# EAGLE design ESP32 TFT Touch with Camera(3.2'' ili9341) v1.1 (EAGLE 6.1)
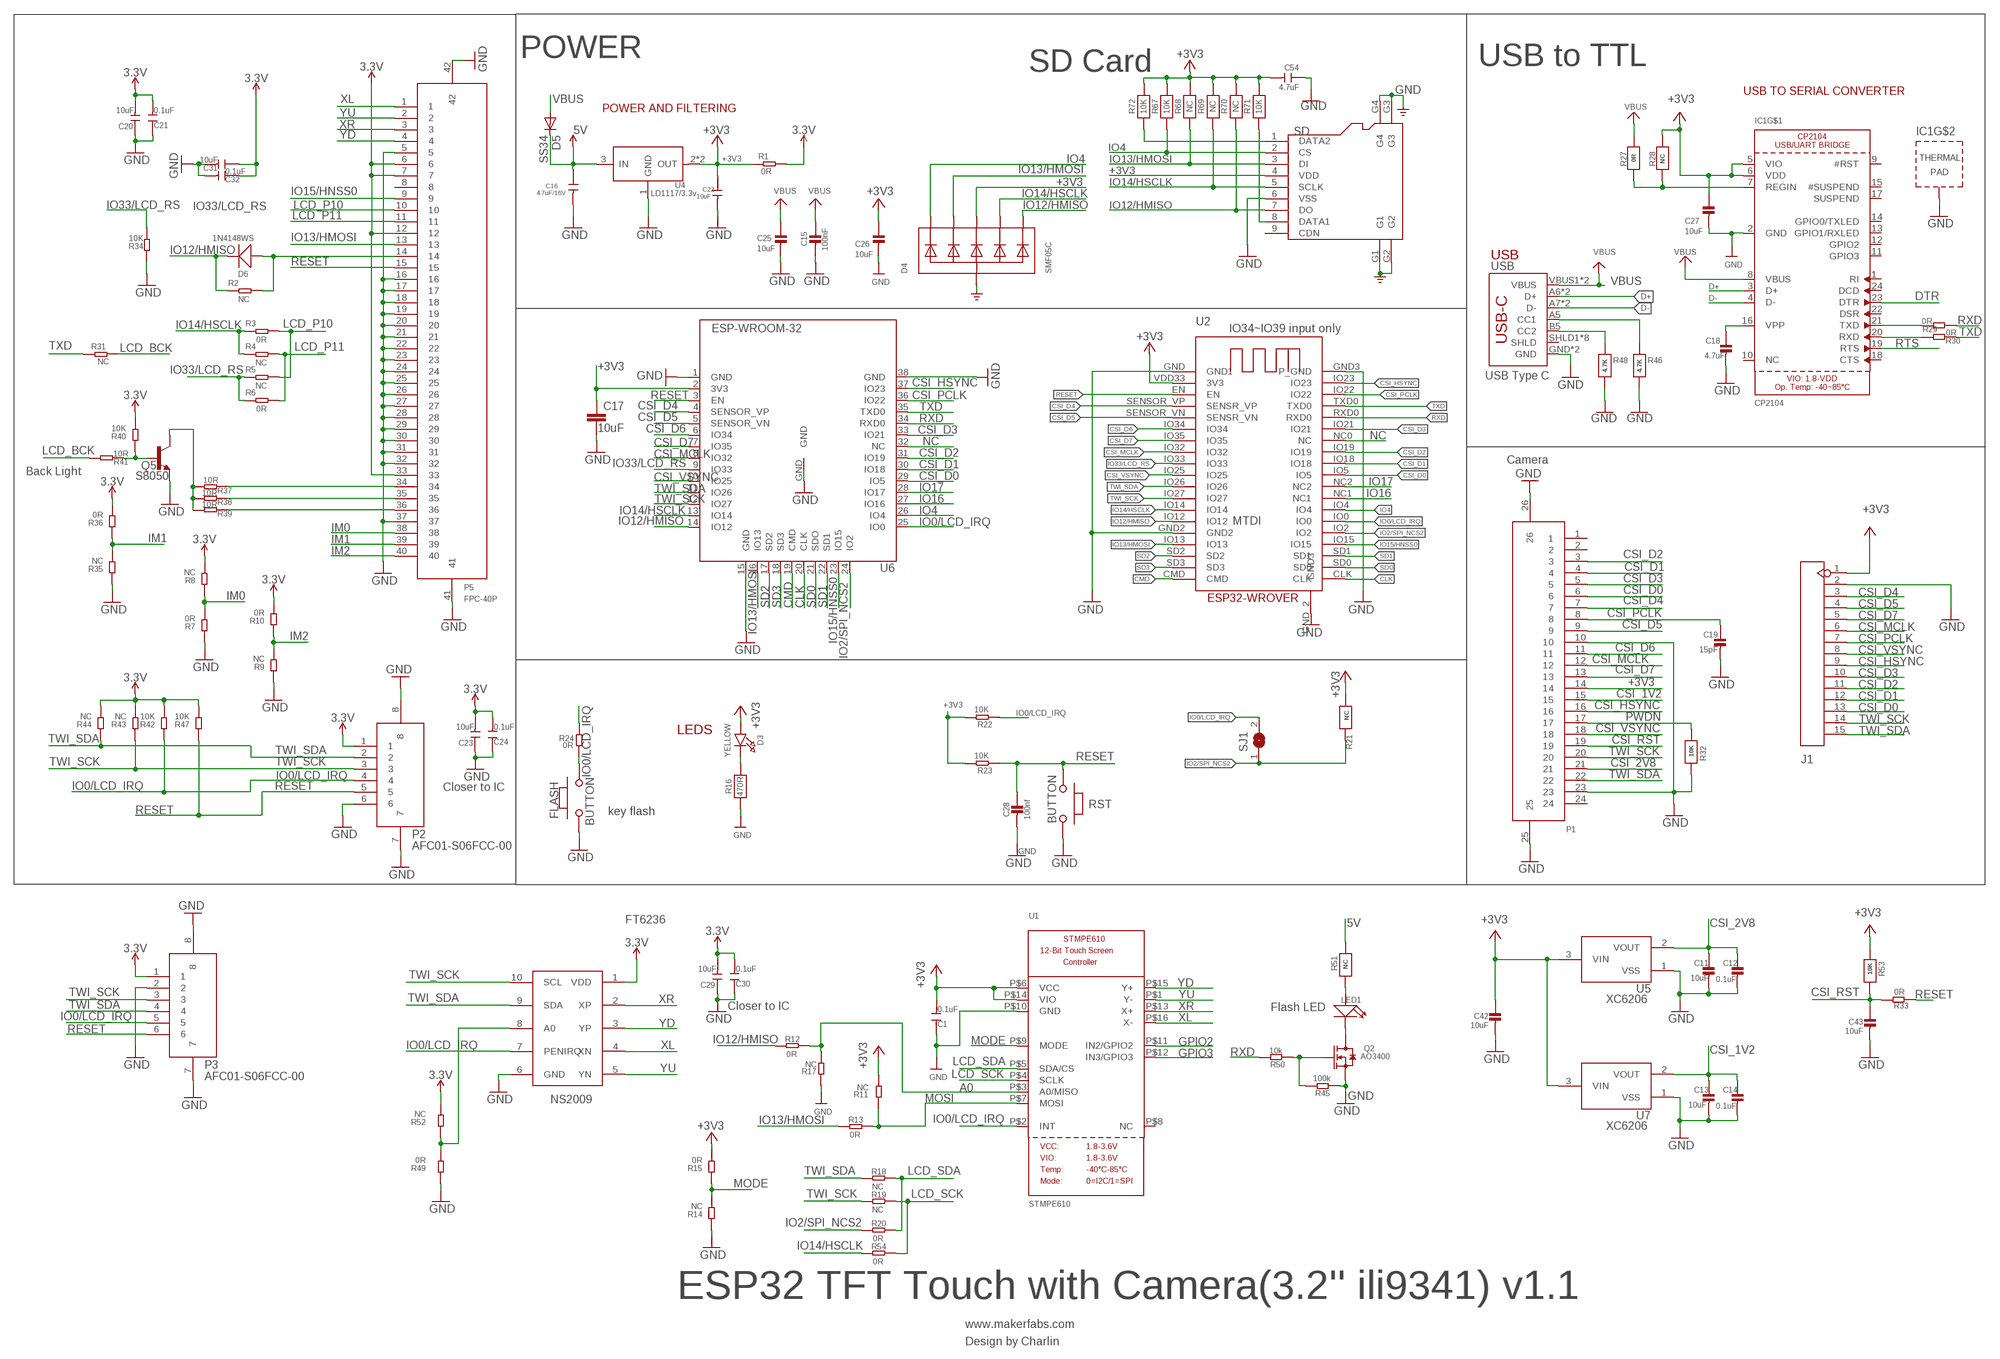
[diagram p0: schematic, sheet 1, part 1 of 2]
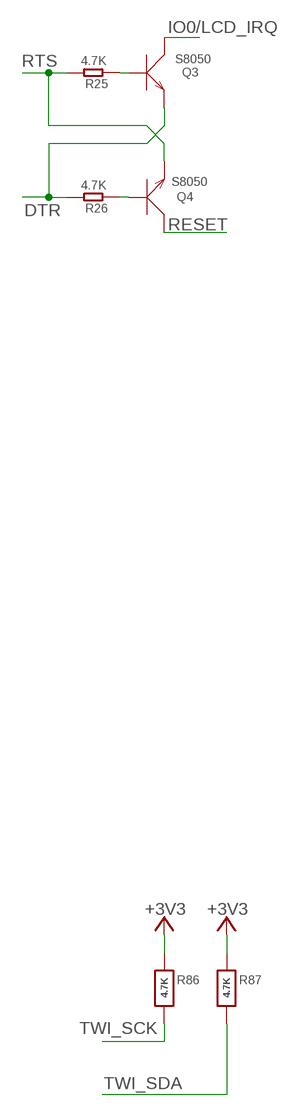
[diagram p1: schematic, sheet 1, part 2 of 2]

## Parts
C1  0.1uF  DISCRETE_C-0603  [DISCRETE_C0603]
C11  10uF  CAP_CERAMIC0603_NO  [0603-NO]
C12  0.1uF  CAP_CERAMIC0603_NO  [0603-NO]
C13  10uF  CAP_CERAMIC0603_NO  [0603-NO]
C14  0.1uF  CAP_CERAMIC0603_NO  [0603-NO]
C15  100nF  CAP_CERAMIC0603_NO  [0603-NO]
C16  4.7uF/16V  C-0603  [0603]
C17  10uF  C-EUC0603  [C0603]
C18  4.7uF  CAP_CERAMIC0603_NO  [0603-NO]
C19  15pF  CAP_CERAMIC0603_NO  [0603-NO]
C20  10uF  DISCRETE_C-0603  [DISCRETE_C0603]
C21  0.1uF  DISCRETE_C-0603  [DISCRETE_C0603]
C22  10uF  C-0603  [0603]
C23  10uF  DISCRETE_C-0603  [DISCRETE_C0603]
C24  0.1uF  DISCRETE_C-0603  [DISCRETE_C0603]
C25  10uF  CAP_CERAMIC0603_NO  [0603-NO]
C26  10uF  CAP_CERAMIC0603_NO  [0603-NO]
C27  10uF  CAP_CERAMIC0603_NO  [0603-NO]
C28  100nf  CAP_CERAMIC0603_NO  [0603-NO]
C29  10uF  DISCRETE_C-0603  [DISCRETE_C0603]
C30  0.1uF  DISCRETE_C-0603  [DISCRETE_C0603]
C31  10uF  DISCRETE_C-0603  [DISCRETE_C0603]
C32  0.1uF  DISCRETE_C-0603  [DISCRETE_C0603]
C42  10uF  CAP_CERAMIC0603_NO  [0603-NO]
C43  10uF  CAP_CERAMIC0603_NO  [0603-NO]
C54  4.7uF  DISCRETE_C-0603  [DISCRETE_C0603]
D3  YELLOW  LED0805_NOOUTLINE  [CHIPLED_0805_NOOUTLINE]
D4  SMF05C  TVSARRAY_5LANE  [SOT363]
D5  SS34  DIODE-DO-214AC  [DO-214AC]
D6  1N4148WS  D'0805'  [SOD323]
FLASH  BUTTON  PB157  [157SW]
IC1  CP2104  [QFN24_4MM_SMSC]
J1  HEADER-1X15P  [SMD15-2.54P8.5H]
LED1  DISCRETE_LED3528  [DISCRETE_LED-3528]
P1  FPC-24P  [SMD26-50P-1760L450W]
P2  AFC01-S06FCC-00  [SMD8-50P-740L535W]
P3  AFC01-S06FCC-00  [SMD8-50P-740L535W]
P5  FPC-40P  [SMD42-50P-2560L490W]
Q2  AO3400  MOSFET-N'SOT23'  [SOT23@1]
Q3  S8050  TRANSISTOR-NPN-SOT23  [SOT23]
Q4  S8050  TRANSISTOR-NPN-SOT23  [SOT23]
Q5  S8050  SPARKFUN_TRANSISTOR_NPNSOT23  [SPARKFUN_SOT23]
R1  0R  R-0603  [R0603]
R2  NC  R-0603  [R0603]
R3  0R  R-0603  [R0603]
R4  NC  R-0603  [R0603]
R5  NC  R-0603  [R0603]
R6  0R  R-0603  [R0603]
R7  0R  DISCRETE_R-0603  [DISCRETE_R0603]
R8  NC  DISCRETE_R-0603  [DISCRETE_R0603]
R9  NC  DISCRETE_R-0603  [DISCRETE_R0603]
R10  0R  DISCRETE_R-0603  [DISCRETE_R0603]
R11  NC  DISCRETE_R-0603  [DISCRETE_R0603]
R12  0R  R-0603  [R0603]
R13  0R  R-0603  [R0603]
R14  NC  DISCRETE_R-0603  [DISCRETE_R0603]
R15  0R  DISCRETE_R-0603  [DISCRETE_R0603]
R16  470R  RESISTOR_0603_NOOUT  [0603-NO]
R17  NC  DISCRETE_R-0603  [DISCRETE_R0603]
R18  NC  R-0603  [R0603]
R19  NC  R-0603  [R0603]
R20  0R  R-0603  [R0603]
R21  NC  RESISTOR_0603_NOOUT  [0603-NO]
R22  10K  R-0603  [R0603]
R23  10K  R-0603  [R0603]
R24  0R  R-0603  [R0603]
R25  4.7K  R-0603  [R0603]
R26  4.7K  R-0603  [R0603]
R27  0R  RESISTOR_0603_NOOUT  [0603-NO]
R28  NC  RESISTOR_0603_NOOUT  [0603-NO]
R29  0R  R-0603  [R0603]
R30  0R  R-0603  [R0603]
R31  NC  R-0603  [R0603]
R32  10K  RESISTOR_0603_NOOUT  [0603-NO]
R33  0R  R-0603  [R0603]
R34  10K  DISCRETE_R-0603  [DISCRETE_R0603]
R35  NC  DISCRETE_R-0603  [DISCRETE_R0603]
R36  0R  DISCRETE_R-0603  [DISCRETE_R0603]
R37  10R  DISCRETE_R-0603  [DISCRETE_R0603]
R38  10R  DISCRETE_R-0603  [DISCRETE_R0603]
R39  10R  DISCRETE_R-0603  [DISCRETE_R0603]
R40  10K  DISCRETE_R-0603  [DISCRETE_R0603]
R41  10R  DISCRETE_R-0603  [DISCRETE_R0603]
R42  10K  DISCRETE_R-0603  [DISCRETE_R0603]
R43  NC  DISCRETE_R-0603  [DISCRETE_R0603]
R44  NC  DISCRETE_R-0603  [DISCRETE_R0603]
R45  100k  R-0603  [R0603]
R46  4.7K  RESISTOR_0603_NOOUT  [0603-NO]
R47  10K  DISCRETE_R-0603  [DISCRETE_R0603]
R48  4.7K  RESISTOR_0603_NOOUT  [0603-NO]
R49  0R  DISCRETE_R-0603  [DISCRETE_R0603]
R50  10k  R-0603  [R0603]
R51  NC  RESISTOR_0603_NOOUT  [0603-NO]
R52  NC  DISCRETE_R-0603  [DISCRETE_R0603]
R53  10K  RESISTOR_0603_NOOUT  [0603-NO]
R54  0R  R-0603  [R0603]
R67  10K  RESISTOR_0603_NOOUT  [0603-NO]
R68  NC  RESISTOR_0603_NOOUT  [0603-NO]
R69  NC  RESISTOR_0603_NOOUT  [0603-NO]
R70  NC  RESISTOR_0603_NOOUT  [0603-NO]
R71  10K  RESISTOR_0603_NOOUT  [0603-NO]
R72  10K  RESISTOR_0603_NOOUT  [0603-NO]
R86  4.7K  RESISTOR_0603_NOOUT  [0603-NO]
R87  4.7K  RESISTOR_0603_NOOUT  [0603-NO]
RST  BUTTON  PB157  [157SW]
SD  HOLDER-MICROSD-9P  [9P-SMD-W/-RING]
SJ1  SJ  [SJ]
U1  STMPE610  [QFN16_3MM]
U2  ESP32-WROVER  [ESP32-WROVER]
U4  LD1117/3.3v  LD1117'SOT89'  [SOT89]
U5  XC6206  [SOT-23]
U6  ESP-WROOM-32  [ESP-WROOM-32]
U7  XC6206  [SOT-23]
U8  NS2009  [MSOP10]
USB  USB_C5  [USB-C-16P-5]

## Nets
3.3V: C20.2 C21.2 C23.2 C24.2 C29.2 C30.2 C31.1 C32.1 P2.1 P3.1 P5.6 P5.7 P5.12 P5.33 R1.2 R8.2 R10.2 R36.2 R40.2 R42.2 R43.2 R44.2 R47.2 R52.2 U8.1(VDD)
5V: C16.1 D5.C R51.1 U4.3(IN)
+3V3: C1.2 C17.1 C22.1 C26.1 C27.1 C42.1 C54.2 D3.A D4.4(C3) IC1.5(VIO) IC1.6(VDD) J1.1 P1.14 R1.1 R11.2 R15.2 R21.1 R22.2 R23.2 R28.1 R53.1 R67.2 R68.2 R69.2 R70.2 R71.2 R72.2 R86.1 R87.1 SD.4(VDD) U1.P$6(VCC) U1.P$14(VIO) U2.VDD33(3V3) U4.2(OUT) U4.4(OUT) U5.3(VIN) U6.2(3V3) U7.3(VIN)
A0: R12.2 R17.2 U1.P$3(A0/MISO)
CLK: U2.CLK U6.20(CLK)
CMD: U2.CMD U6.19(CMD)
CSI_1V2: C13.1 C14.1 P1.15 U7.2(VOUT)
CSI_2V8: C11.1 C12.1 P1.21 U5.2(VOUT)
CSI_D0: J1.13 P1.6 U2.IO5 U6.29(IO5)
CSI_D1: J1.12 P1.4 U2.IO18 U6.30(IO18)
CSI_D2: J1.11 P1.3 U2.IO19 U6.31(IO19)
CSI_D3: J1.10 P1.5 U2.IO21 U6.33(IO21)
CSI_D4: J1.3 P1.7 U2.SENSOR_VP(SENSR_VP) U6.4(SENSOR_VP)
CSI_D5: J1.4 P1.9 U2.SENSOR_VN(SENSR_VN) U6.5(SENSOR_VN)
CSI_D6: P1.11 U2.IO34 U6.6(IO34)
CSI_D7: J1.5 P1.13 U2.IO35 U6.7(IO35)
CSI_HSYNC: J1.9 P1.16 U2.IO23 U6.37(IO23)
CSI_MCLK: J1.6 P1.12 U2.IO32 U6.8(IO32)
CSI_PCLK: C19.1 J1.7 P1.8 U2.IO22 U6.36(IO22)
CSI_RST: C43.1 P1.19 R33.2 R53.2
CSI_VSYNC: J1.8 P1.18 U2.IO25 U6.10(IO25)
D+: IC1.3(D+) USB.A6(D+) USB.B6(D+)
D-: IC1.4(D-) USB.A7(D-) USB.B7(D-)
DTR: IC1.23(DTR) Q3.2(E) R26.2
GND: C1.1 C11.2 C12.2 C13.2 C14.2 C15.2 C16.2 C17.2 C18.2 C19.2 C20.1 C21.1 C22.2 C23.1 C24.1 C25.2 C26.2 C27.2 C28.2 C29.1 C30.1 C31.2 C32.2 C42.2 C43.2 C54.1 D4.2(A) FLASH.1 IC1.2(GND) IC1.THERM(TP) J1.2 P1.10 P1.23 P1.25 P1.26 P2.6 P2.7 P2.8 P3.2 P3.7 P3.8 P5.5 P5.16 P5.17 P5.18 P5.19 P5.20 P5.21 P5.22 P5.23 P5.24 P5.25 P5.26 P5.27 P5.28 P5.29 P5.30 P5.31 P5.32 P5.37 P5.41 P5.42 Q2.2(S) Q5.2(E) R7.1 R9.1 R14.1 R16.1 R17.1 R32.2 R34.1 R35.1 R45.1 R46.2 R48.2 R49.1 RST.1 SD.6(VSS) SD.G1 SD.G2 SD.G3 SD.G4 U1.P$10(GND) U2.GND2 U2.GND3(P_GND) U2.GND(GND1) U2.GND_2(GND3) U4.1(GND) U5.1(VSS) U6.1(GND) U6.15(GND) U6.38(GND) U6.GND U7.1(VSS) U8.6(GND) USB.GND USB.GND2(GND)
GPIO2: U1.P$11(IN2/GPIO2)
GPIO3: U1.P$12(IN3/GPIO3)
IM0: P5.38 R7.2 R8.1
IM1: P5.39 R35.2 R36.1
IM2: P5.40 R9.2 R10.1
IO0/LCD_IRQ: P2.4 P3.5 Q3.3(C) R22.1 R24.2 R42.1 SJ1.2 U1.P$2(INT) U2.IO0 U6.25(IO0) U8.7(PENIRQ)
IO2/SPI_NCS2: R20.1 R21.2 SJ1.1 U2.IO2 U6.24(IO2)
IO4: D4.1(C1) R67.1 SD.2(CS) U2.IO4 U6.26(IO4)
IO12/HMISO: D4.6(C5) D6.- R2.1 R12.1 R70.1 SD.7(DO) U2.IO12 U6.14(IO12)
IO13/HMOSI: D4.3(C2) P5.13 R13.1 R68.1 SD.3(DI) U2.IO13 U6.16(IO13)
IO14/HSCLK: D4.5(C4) R3.1 R4.1 R54.1 R69.1 SD.5(SCLK) U2.IO14 U6.13(IO14)
IO15/HNSS0: P5.9 U2.IO15 U6.23(IO15)
IO16: U2.NC1 U6.27(IO16)
IO17: U2.NC2 U6.28(IO17)
IO33/LCD_RS: R5.1 R6.1 R34.2 U2.IO33 U6.9(IO33)
LCD_BCK: R31.2 R41.2
LCD_P10: P5.10 R3.2 R5.2
LCD_P11: P5.11 R4.2 R6.2
LCD_SCK: R19.2 R54.2 U1.P$4(SCLK)
LCD_SDA: R18.2 R20.2 U1.P$5(SDA/CS)
MODE: R14.2 R15.1 U1.P$9(MODE)
MOSI: R11.1 R13.2 U1.P$7(MOSI)
N$1: C18.1 IC1.16(VPP)
N$2: Q4.1(B) R26.1
N$3: Q3.1(B) R25.1
N$4: D6.+ P5.14 R2.2
N$5: Q2.1(G) R45.2 R50.1
N$6: FLASH.2 R24.1
N$7: D3.C R16.2
N$8: LED1.1(+) R51.2
N$9: LED1.2(-) Q2.3(D)
N$10: R46.1 USB.A5(CC1)
N$11: R48.1 USB.B5(CC2)
N$12: IC1.7(REGIN) R27.2 R28.2
N$18: IC1.21(TXD) R29.2
N$19: IC1.20(RXD) R30.2
N$20: P5.34 R37.1
N$21: P5.35 R38.1
N$22: P5.36 R39.1
N$23: Q5.1(B) R40.1 R41.1
N$24: Q5.3(C) R37.2 R38.2 R39.2
N$25: R49.2 R52.1 U8.8(A0)
N$47: R72.1 SD.1(DATA2)
N$48: R71.1 SD.8(DATA1)
NC: U2.NC0(NC) U6.32(NC)
PWDN: P1.17 R32.1
RESET: C28.1 P2.5 P3.6 P5.15 Q4.3(C) R23.1 R33.1 R47.1 RST.2 U2.EN U6.3(EN)
RTS: IC1.19(RTS) Q4.2(E) R25.2
RXD: R29.1 R50.2 U2.RXD0 U6.34(RXD0)
SD0: U2.SD0 U6.21(SDO)
SD1: U2.SD1 U6.22(SD1)
SD2: U2.SD2 U6.17(SD2)
SD3: U2.SD3 U6.18(SD3)
TWI_SCK: J1.14 P1.20 P2.3 P3.3 R19.1 R43.1 R86.2 U2.IO27 U6.12(IO27) U8.10(SCL)
TWI_SDA: J1.15 P1.22 P2.2 P3.4 R18.1 R44.1 R87.2 U2.IO26 U6.11(IO26) U8.9(SDA)
TXD: R30.1 R31.1 U2.TXD0 U6.35(TXD0)
VBUS: C15.1 C25.1 D5.A IC1.8(VBUS) R27.1 USB.VBUS1(VBUS) USB.VBUS2(VBUS)
XL: P5.1 U1.P$16(X-) U8.4(XN)
XR: P5.3 U1.P$13(X+) U8.2(XP)
YD: P5.4 U1.P$15(Y+) U8.3(YP)
YU: P5.2 U1.P$1(Y-) U8.5(YN)
Unconnected: IC1.1(RI) IC1.9(#RST) IC1.10(NC) IC1.11(GPIO3) IC1.12(GPIO2) IC1.13(GPIO1/RXLED) IC1.14(GPIO0/TXLED) IC1.15(#SUSPEND) IC1.17(SUSPEND) IC1.18(CTS) IC1.22(DSR) IC1.24(DCD) P1.1 P1.2 P1.24 P5.8 SD.9(CDN) U1.P$8(NC) USB.SHLD1(SHLD) USB.SHLD2(SHLD) USB.SHLD3(SHLD) USB.SHLD4(SHLD) USB.SHLD5(SHLD) USB.SHLD6(SHLD) USB.SHLD7(SHLD) USB.SHLD8(SHLD)

## Notes on the sheet
- POWER | USB to TTL
- SD Card
- USB TO SERIAL CONVERTER
- POWER AND FILTERING
- IO33/LCD_RS
- USB
- IO34~IO39 input only
- USB Type C
- Camera
- Back Light
- MTDI
- LEDS
- Closer to IC
- key flash
- FT6236
- Closer to IC | Flash LED
- NS2009
- ESP32 TFT Touch with Camera(3.2'' ili9341) v1.1
- www.makerfabs.com
- Design by Charlin

## Library data of the parts
C1 C20 C21 C23 C24 C29-C32 C54 = A9G:DISCRETE_C*: Ceramic Capacitors
C11-C15 C18 C19 C25-C28 C42 C43 = microbuilder:CAP_CERAMIC: Ceramic Capacitors For new designs, use the packages preceded by an '_' character since they are more reliable: The following footprints should be used on most boards: _0402 - Standard footprint for regular board layouts _0603 - Standard footprint for regular board layouts _0805 - Standard footprint for regular board layouts _1206 - Standard footprint for regular board layouts For extremely tight-pitch boards where space is at a premium, the following 'micro-pitch' footprints can be used (smaller pads, no silkscreen outline, etc.): _0402MP - Micro-pitch footprint for very dense/compact boards _0603MP - Micro-pitch footprint for very dense/compact boards _0805MP - Micro-pitch footprint for very dense/compact boards _1206MP - Micro-pitch footprint for very dense/compact boards
C16 C22 = Discrete:C*: Ceramic Capacitors
C17 = rcl:C-EU: CAPACITOR, European symbol
D3 = microbuilder:LED: LED 0603 - 0603 Surface Mount Package 2mA: Green LED - Low Power (3.9mcd, 2ma, 1.7Vf) - Digikey: 475-2709-2-ND Orange LED - Low Power (9.8mcd, 2ma, 1.8Vf) - Digikey: 475-1194-2-ND Red LED - Low Power (5mcd, 2ma, 1.8Vf) - Digikey: 475-1195-2-ND Yellow LED - Low Power (7mcd, 2ma, 1.8Vf) - Digikey: 475-1196-2-ND 5mA: Blue LED - Low Power (17mcd, 5ma, 2.9Vf) - Digikey: LNJ937W8CRACT-ND 0805 - 0805 Surface Mount Package 2mA: Red LED (8.8mcd, 2mA, 1.8Vf, Clear) - Low Power [Digikey: 475-2510-1-ND] Green LED (5mcd, 2mA, 1.8Vf, Clear) - Low Power [Digikey: 475-2730-1-ND] Yellow LED (11.3mcd, 2mA, 1.8Vf, Clear) - Low Power [Digikey: 475-2555-1-ND] 20mA: Red LED (104mcd, 20mA, Diffused) - LS R976 [Digikey: 475-1278-6-ND] Red LED (12mcd, 20mA, 2.0Vf, Clear) - APT2012EC [Digikey: 754-1128-1-ND] Green LED (15mcd, 20mA, 2.2Vf, Clear) - APT2012GC [Digikey: 754-1131-1-ND] Orange LED (160mcd, 20mA, 2.1Vf, Clear) - APT2012SECK [Digikey: 754-1130-1-ND] 1206 - 1206 Surface Mount Package Green LED (26mcd, 20mA, Diffused) - LG N971 [Digikey: 475-1407-6-ND] Red LED (15mcd, 20mA, Diffused) - LH N974 [Digikey: 475-1416-6-ND] Cree - Cree High-Power Surface Mount LEDs XPEBWT-L1-0000-00D50 - White 111lm 350mA 2.9Vf 6200K 110° XTEAWT-00-0000-00000LEE3 - White 114lm 350mA 2.85Vf 5000K 115° Everlight - Everlight 45-21 Series Surface Mount LEDs 45-21/QK2C-B2832AC2CB2/2T - Warm White 2000mcd 20mA 3.25Vf 3050K 120° 45-21/LK2C-B38452C4CB2/2T - Nuetral White 2000mcd 20mA 3.25Vf 4150K 120° 45-21/LK2C-B50634C6CB2/2T - Cold White 2200mcd 20mA 3.25Vf 5650K 120° PLCC2 Reverse Mount LS T77K-J1L2-1-0-2-R18-Z - Red 11.25mcd 2mA 1.8Vf 630nm 120° LO T77K-L1M2-24-Z - Orange 19.6mcd 2mA 1.8Vf 606nm 120° LY T77K-K2M1-26-Z - Yellow 15.7mcd 2mA 1.8Vf 587nm 120°
D4 = microbuilder:TVSARRAY_5LANE: Voltage Transient Suppressor Array SOT363 SMF05C - 100W 5V: Digikey - SMF05CT1GOSCT-ND
D5 = diode:DIODE-: DIODE
D6 = Discrete:D*
FLASH RST = MySMD:PB157
IC1 = microbuilder:CP2104: CP2104 - USB to UART Bridge VDD Output: 3.45V
J1 = self:HEADER-1X15P
LED1 = Relay:DISCRETE_LED*
P1 = self:FPC-24P
P2 P3 = self:AFC01-S06FCC-00
P5 = self:FPC-40P
Q2 = Discrete:MOSFET-N: IRLL014: http://www.vishay.com/docs/91319/sihll014.pdf
Q3 Q4 = Discrete:TRANSISTOR-NPN*: NPN audion
Q5 = Adafruit_HUZZAH32_ESP32_Feather:SPARKFUN_TRANSISTOR_NPN: Transistor NPN BJT configuration in SOT23 package. MMBT2222 is the common NPN we use. Double check BCE configuration again layout.
R1-R6 R12 R13 R18-R20 R22-R26 R29-R31 R33 R45 R50 R54 = Discrete:R*
R7-R11 R14 R15 R17 R34-R44 R47 R49 R52 = A9G:DISCRETE_R*
R16 R21 R27 R28 R32 R46 R48 R51 R53 R67-R72 R86 R87 = microbuilder:RESISTOR: Resistors For new designs, use the packages preceded by an '_' character since they are more reliable: The following footprints should be used on most boards: _0402 - Standard footprint for regular board layouts _0603 - Standard footprint for regular board layouts _0805 - Standard footprint for regular board layouts _1206 - Standard footprint for regular board layouts For extremely tight-pitch boards where space is at a premium, the following 'micro-pitch' footprints can be used (smaller pads, no silkscreen outline, etc.): _0402MP - Micro-pitch footprint for very dense/compact boards _0603MP - Micro-pitch footprint for very dense/compact boards _0805MP - Micro-pitch footprint for very dense/compact boards _1206MP - Micro-pitch footprint for very dense/compact boards
SD = Connector:HOLDER-MICROSD-9P
SJ1 = jumper:SJ: SMD solder JUMPER
U1 = microbuilder:STMPE610: STMPE610 - 12-Bit Touch Screen Controller
U2 = ESP32-Wrover:ESP32-WROVER
U4 = IC:LD1117: Low Drop Fixed And Adjustable Positive Voltage Regulators http://www.datasheetcatalog.org/datasheet/SGSThomsonMicroelectronics/mXuqtqv.pdf
U5 U7 = self:XC6206
U6 = esp32:ESP-WROOM-32
U8 = NS2009:NS2009
USB = USBC:USB_C: USB Type C 16Pin Connector Super Speed pins not available on the 16-pin purely SMD connector so this part is best for USB 2.0 implementations. D1 and D2 are tied together enabling D+/- no matter which way the cable is plugged into the connector. The two channel configuration pins (CC1/2) are exposed. These are normally connected to ground via 5.1k resistors but can be reconfigured for high current/high power applications.

## Net classes
1 vbat: width 0.254 mm, drill 0.305 mm, clearance 0.152 mm

## Board
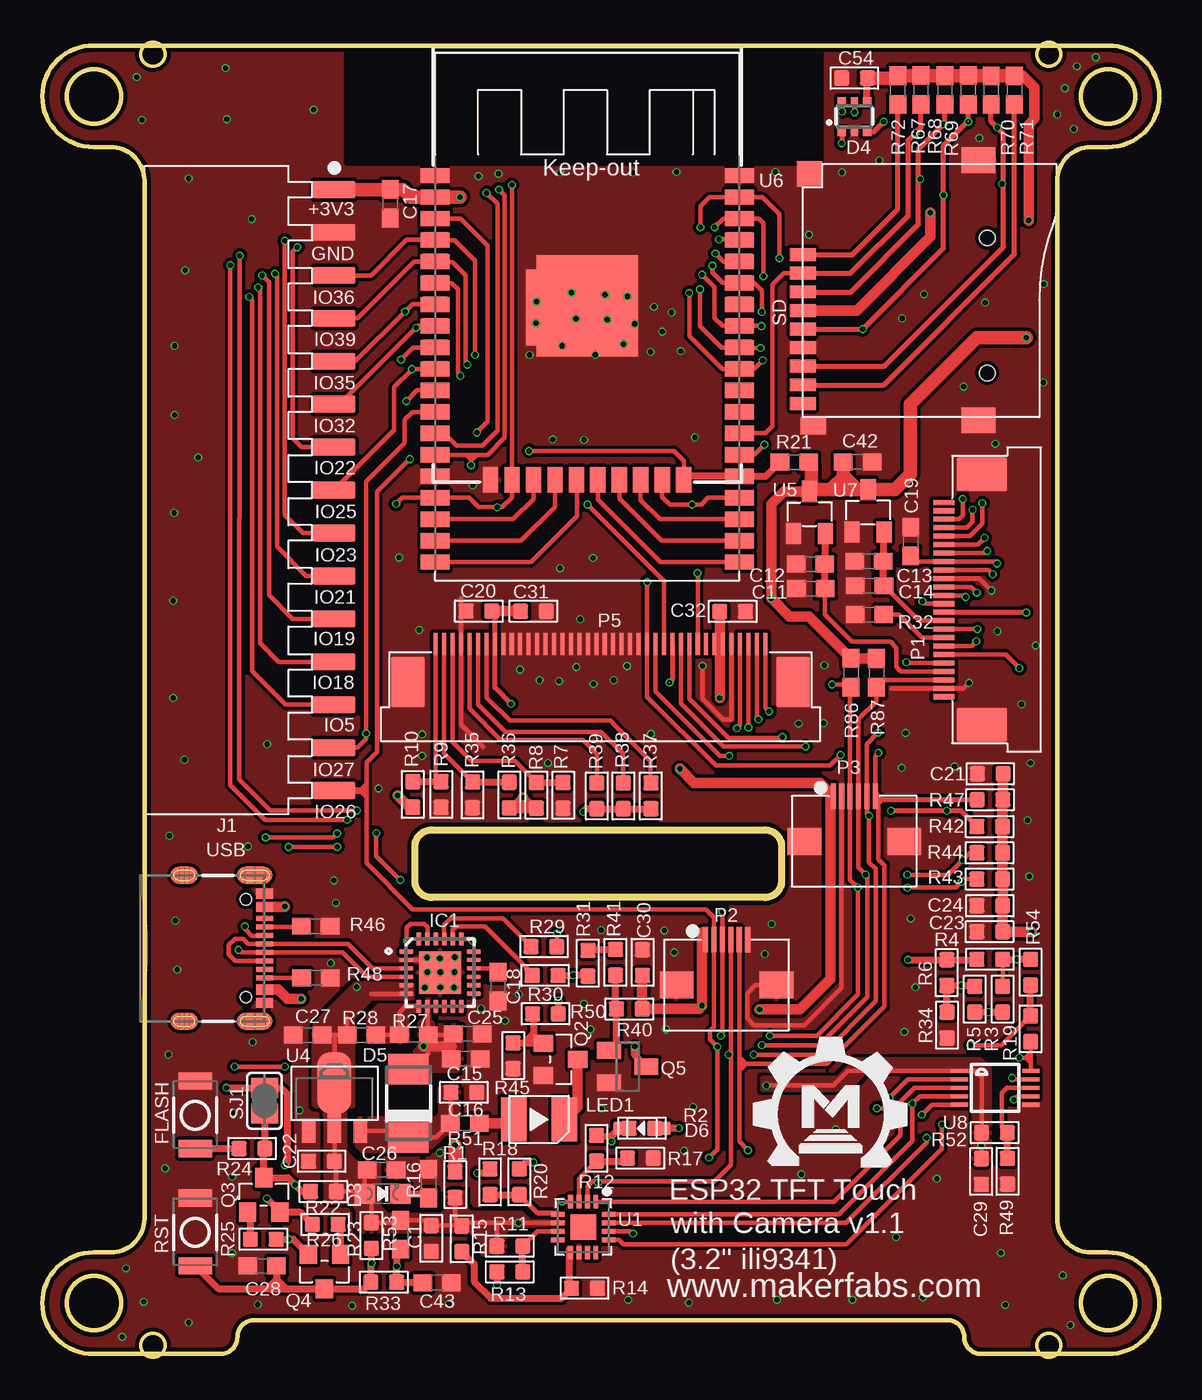
[diagram p2: board, top side]
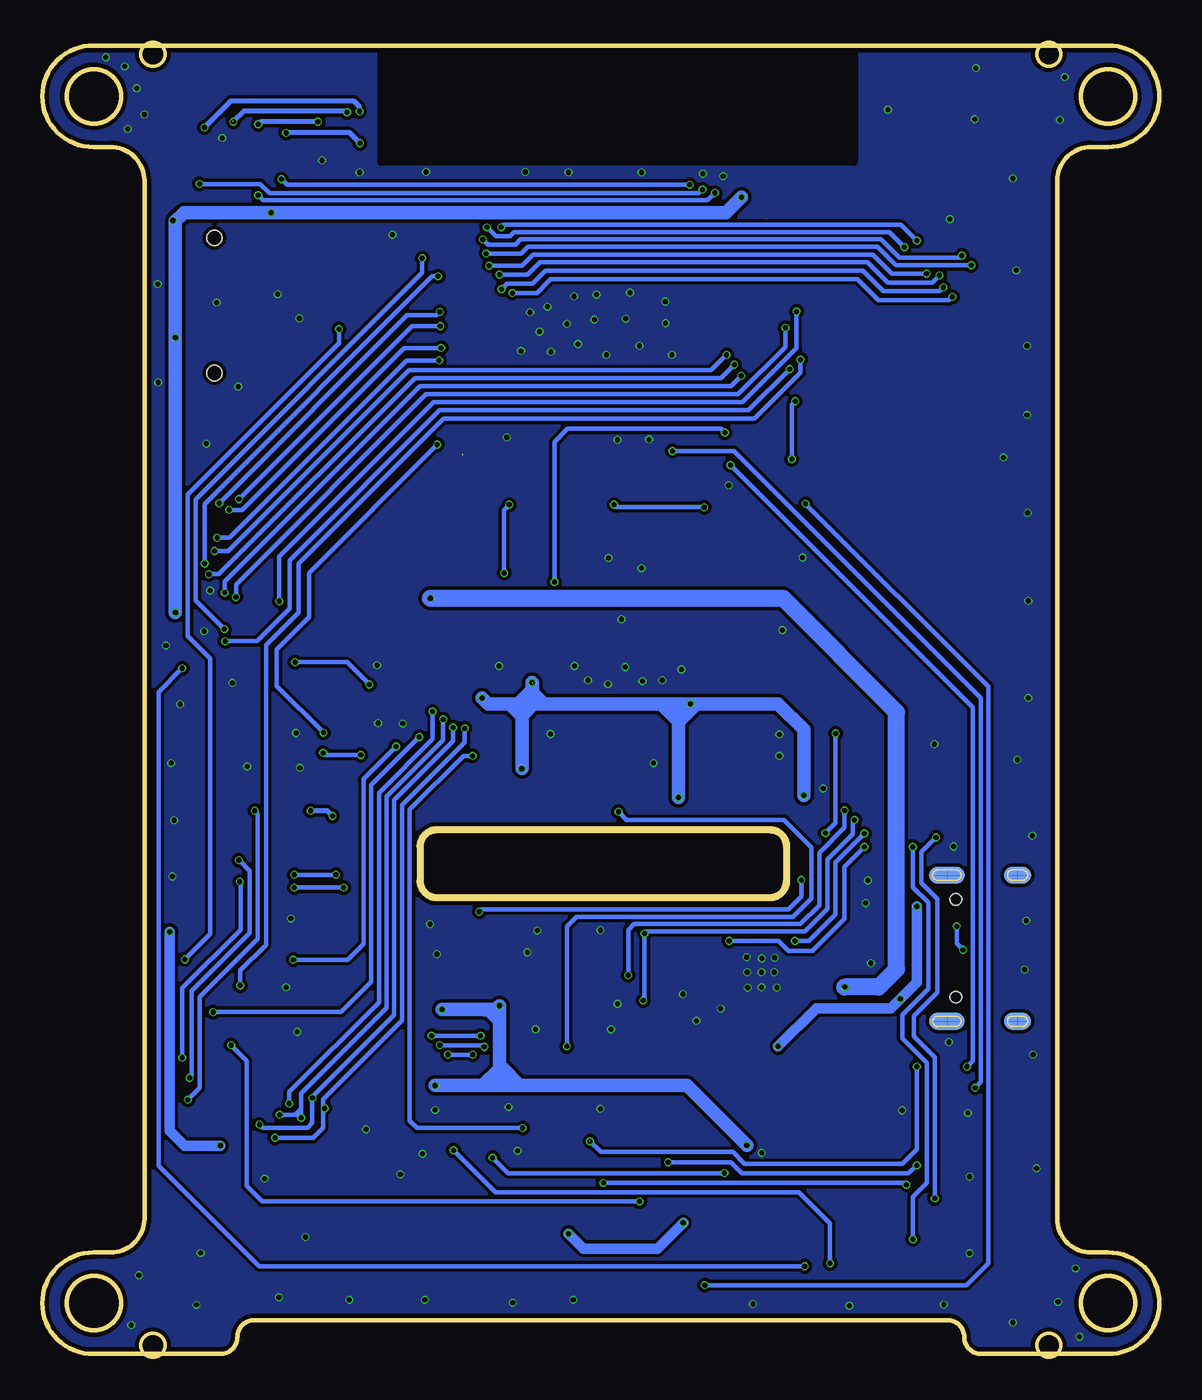
[diagram p3: board, bottom side, seen from below]

Size 66.1 x 77.8 mm. Coordinates in mm from the lower left corner, seen from the top.
Outline: 55.55,0.2 63.05,0.2 arc182 63.05,6.2 62.05,6.2 arc-90 60.05,8.2 60.05,69.6 arc-90 62.05,71.6 63.05,71.6 arc182 63.05,77.6 3.05,77.6 arc182 3.05,71.6 4.05,71.6 arc-90 6.05,69.6 6.05,8.2 arc-90 4.05,6.2 3.05,6.2 arc182 3.05,0.2 10.55,0.2 arc90 11.55,1.2 arc-90 12.55,2.2 53.55,2.2 arc-90 54.55,1.2 arc90 55.55,0.2
Outline: 23.05,31.2 42.75,31.2 arc-90 43.75,30.2 43.75,28.2 arc-90 42.75,27.2 23.05,27.2 arc-90 22.05,28.2 22.05,30.2 arc-90 23.05,31.2
Outline: circle at 3.05,74.6 radius 1.6
Outline: circle at 3.05,3.2 radius 1.6
Outline: circle at 63.05,3.2 radius 1.6
Outline: circle at 63.05,74.6 radius 1.6
Outline: circle at 6.55,0.7 radius 0.7
Outline: circle at 59.55,0.7 radius 0.7
Outline: circle at 59.55,77.1 radius 0.7
Outline: circle at 6.55,77.1 radius 0.7
Copper layers (1*16): Top 0.035mm / dielectric 1.5mm / Bottom 0.035mm
Design rules: minimum track width 6mil, minimum drill 10mil, track to track 6mil, track to pad 6mil, pad to pad 6mil, via to via 6mil, smd to smd 0mil, copper to edge 10mil, drill to drill 10mil, minimum pad ring 3mil, minimum via ring 3mil, stop-mask expansion 2mil, vias tented up to drill 100mil, thermal gap 0mil
tRestrict: area 18,70.7 to 46,77.7
bRestrict: area 18,70.7 to 46,77.7

### Footprints (pad centres in the part's own frame; a part is rotated, then mirrored left to right if it is on the bottom)
DISCRETE_C0603 = smd 0.889 x 0.889: 1 -0.762,0; 2 0.762,0
0603-NO = smd 1.1 x 1: 1 -0.85,0; 2 0.85,0
0603 = smd 0.889 x 0.889: 1 -0.762,0; 2 0.762,0
C0603 = smd 1.1 x 1: 1 -0.85,0; 2 0.85,0
CHIPLED_0805_NOOUTLINE = smd 1.2 x 1.2: A 0,-1.05; C 0,1.05
SOT363 = smd 0.5 x 0.5: 1 -0.75,-0.9; 3 0.75,-0.9; 4 0.75,0.9; 6 -0.75,0.9 | smd 0.4 x 0.5: 2 0,-0.9; 5 0,0.9
DO-214AC = smd 1.8 x 2.4: A 2.025,0; C -2.025,0
SOD323 = smd 1 x 0.8: + -1.2,0; - 1.2,0
157SW = smd 1.016 x 1.981: 1 0,0; 2 4,0
QFN24_4MM_SMSC = smd 0.8 x 0.28: 1 -2,1.25; 2 -2,0.75; 3 -2,0.25; 4 -2,-0.25; 5 -2,-0.75; 6 -2,-1.25; 13 2,-1.25; 14 2,-0.75; 15 2,-0.25; 16 2,0.25; 17 2,0.75; 18 2,1.25 | smd 0.28 x 0.8: 7 -1.25,-2; 8 -0.75,-2; 9 -0.25,-2; 10 0.25,-2; 11 0.75,-2; 12 1.25,-2; 19 1.25,2; 20 0.75,2; 21 0.25,2; 22 -0.25,2; 23 -0.75,2; 24 -1.25,2 | smd 2.5 x 2.5: THERM 0,0
SMD15-2.54P8.5H = smd 1.02 x 2.5: 1 -17.78,0; 2 -15.24,0; 3 -12.7,0; 4 -10.16,0; 5 -7.62,0; 6 -5.08,0; 7 -2.54,0; 8 0,0; 9 2.54,0; 10 5.08,0; 11 7.62,0; 12 10.16,0; 13 12.7,0; 14 15.24,0; 15 17.78,0
DISCRETE_LED-3528 = smd 1.5 x 2.6: 1 -1.5,0; 2 1.5,0
SMD26-50P-1760L450W = smd 0.3 x 1.3: 1 5.75,0; 2 5.25,0; 3 4.75,0; 4 4.25,0; 5 3.75,0; 6 3.25,0; 7 2.75,0; 8 2.25,0; 9 1.75,0; 10 1.25,0; 11 0.75,0; 12 0.25,0; 13 -0.25,0; 14 -0.75,0; 15 -1.25,0; 16 -1.75,0; 17 -2.25,0; 18 -2.75,0; 19 -3.25,0; 20 -3.75,0; 21 -4.25,0; 22 -4.75,0; 23 -5.25,0; 24 -5.75,0 | smd 2 x 3: 25 -7.4,-2.25; 26 7.4,-2.25
SMD8-50P-740L535W = smd 0.3 x 1.5: 1 -1.25,0; 2 -0.75,0; 3 -0.25,0; 4 0.25,0; 5 0.75,0; 6 1.25,0 | smd 2 x 1.6: 7 2.95,-2.68; 8 -2.95,-2.68
SMD42-50P-2560L490W = smd 0.3 x 1.3: 1 9.75,0; 2 9.25,0; 3 8.75,0; 4 8.25,0; 5 7.75,0; 6 7.25,0; 7 6.75,0; 8 6.25,0; 9 5.75,0; 10 5.25,0; 11 4.75,0; 12 4.25,0; 13 3.75,0; 14 3.25,0; 15 2.75,0; 16 2.25,0; 17 1.75,0; 18 1.25,0; 19 0.75,0; 20 0.25,0; 21 -0.25,0; 22 -0.75,0; 23 -1.25,0; 24 -1.75,0; 25 -2.25,0; 26 -2.75,0; 27 -3.25,0; 28 -3.75,0; 29 -4.25,0; 30 -4.75,0; 31 -5.25,0; 32 -5.75,0; 33 -6.25,0; 34 -6.75,0; 35 -7.25,0; 36 -7.75,0; 37 -8.25,0; 38 -8.75,0; 39 -9.25,0; 40 -9.75,0 | smd 2 x 3: 41 -11.4,-2.25; 42 11.4,-2.25
SOT23@1 = smd 1.016 x 1.143: 1 -0.95,-1.016; 2 0.95,-1.016; 3 0,1.016
SOT23 = smd 1.016 x 1.143: 1 -0.95,-1.016; 2 0.95,-1.016; 3 0,1.016
SPARKFUN_SOT23 = smd 1 x 1.4: 1 -0.95,-1.1; 2 0.95,-1.1; 3 0,1.1
R0603 = smd 0.889 x 0.889: 1 -0.762,0; 2 0.762,0
DISCRETE_R0603 = smd 0.889 x 0.889: 1 -0.762,0; 2 0.762,0
9P-SMD-W/-RING = smd 1.524 x 0.762: 1 0,4.4; 2 0,3.3; 3 0,2.2; 4 0,1.1; 5 0,0; 6 0,-1.1; 7 0,-2.2; 8 0,-3.3; 9 0,-4.4 | smd 1.524 x 1.016: G1 0.6,-5.746 | smd 2.032 x 1.524: G2 10.373,-5.4; G3 10.373,10 | smd 1.524 x 1.524: G4 0.392,9.181 | hole 0.889: 10.9,-2.6; 10.9,5.4
SJ = smd 1.168 x 1.6: 1 -0.762,0; 2 0.762,0
QFN16_3MM = smd 0.8 x 0.28: P$1 -1.5,0.75; P$2 -1.5,0.25; P$3 -1.5,-0.25; P$4 -1.5,-0.75; P$9 1.5,-0.75; P$10 1.5,-0.25; P$11 1.5,0.25; P$12 1.5,0.75 | smd 0.28 x 0.8: P$5 -0.75,-1.5; P$6 -0.25,-1.5; P$7 0.25,-1.5; P$8 0.75,-1.5; P$13 0.75,1.5; P$14 0.25,1.5; P$15 -0.25,1.5; P$16 -0.75,1.5 | smd 1.5 x 1.5: THERMAL 0,0
ESP32-WROVER = smd 1.7 x 0.9: CLK 18,1.27; CMD 0,1.27; EN 0,21.59; GND 0,24.13; GND3 18,24.13; GND_2 0,6.35; IO0 18,7.62; IO2 18,6.35; IO4 18,8.89; IO5 18,12.7; IO12 0,7.62; IO13 0,5.08; IO14 0,8.89; IO15 18,5.08; IO18 18,13.97; IO19 18,15.24; IO21 18,17.78; IO22 18,21.59; IO23 18,22.86; IO25 0,12.7; IO26 0,11.43; IO27 0,10.16; IO32 0,15.24; IO33 0,13.97; IO34 0,17.78; IO35 0,16.51; NC0 18,16.51; NC1 18,10.16; NC2 18,11.43; RXD0 18,19.05; SD0 18,2.54; SD1 18,3.81; SD2 0,3.81; SD3 0,2.54; SENSOR_VN 0,19.05; SENSOR_VP 0,20.32; TXD0 18,20.32; VDD33 0,22.86 | smd 4.5 x 4.5: GND2 7.62,16.34
SOT89 = smd 0.8 x 1.4: 1 -1.524,-1.905; 3 1.524,-1.905 | smd 0.8 x 1.9: 2 0,-1.651 | smd 2.032 x 3.65: 4 0,0.94
SOT-23 = smd 0.9 x 1.25: 1 -0.95,-1.25; 2 0.95,-1.25; 3 0,1.25
ESP-WROOM-32 = smd 0.9 x 1.5: 1 7.7,9; 2 6.43,9; 3 5.16,9; 4 3.89,9; 5 2.62,9; 6 1.35,9; 7 0.08,9; 8 -1.19,9; 9 -2.46,9; 10 -3.73,9; 11 -5,9; 12 -6.27,9; 13 -7.54,9; 14 -8.81,9; 25 -8.81,-9; 26 -7.54,-9; 27 -6.27,-9; 28 -5,-9; 29 -3.73,-9; 30 -2.46,-9; 31 -1.19,-9; 32 0.08,-9; 33 1.35,-9; 34 2.62,-9; 35 3.89,-9; 36 5.16,-9; 37 6.43,-9; 38 7.7,-9 | smd 1.5 x 0.9: 15 -10.3,5.715; 16 -10.3,4.445; 17 -10.3,3.175; 18 -10.3,1.905; 19 -10.3,0.635; 20 -10.3,-0.635; 21 -10.3,-1.905; 22 -10.3,-3.175; 23 -10.3,-4.445; 24 -10.3,-5.715 | smd 6 x 6: GND 0,0
MSOP10 = smd 0.25 x 1: 1 -1,-2.113; 2 -0.5,-2.113; 3 0,-2.113; 4 0.5,-2.113; 5 1,-2.113; 6 1,2.113; 7 0.5,2.113; 8 0,2.113; 9 -0.5,2.113; 10 -1,2.113
USB-C-16P-5 = smd 0.3 x 1: A5 -1.25,-0.34; A6 -0.25,-0.34; A7 0.25,-0.34; A8 1.25,-0.34; B5 1.75,-0.34; B6 0.75,-0.34; B7 -0.75,-0.34; B8 -1.75,-0.34 | smd 0.6 x 1: GND -3.225,-0.34; GND2 3.225,-0.34; VBUS1 -2.45,-0.34; VBUS2 2.45,-0.34 | smd 1 x 2.1: SHLD1 -4.32,-0.915; SHLD2 4.32,-0.915 | smd 1 x 2.1 bottom: SHLD3 -4.32,-0.915; SHLD4 4.32,-0.915 | smd 1 x 1.6: SHLD5 -4.32,-5.095; SHLD8 4.32,-5.095 | smd 1 x 1.6 bottom: SHLD6 -4.32,-5.095; SHLD7 4.32,-5.095 | hole 0.65: -2.89,-1.445; 2.89,-1.445

### Placement (x,y rotation side)
C1  23.02,7.03 90 top
C11  45.47,45.47 180 top
C12  45.45,46.92 180 top
C13  48.91,47.09 180 top
C14  48.95,45.64 180 top
C15  25.06,17.65 0 top
C16  24.95,15.67 0 top
C17  20.59,68.24 270 top
C18  26.96,21.93 270 top
C19  51.38,48.26 90 top
C20  25.83,44.15 0 top
C21  56.09,34.52 0 top
C22  16.52,11.6 180 top
C23  56.06,25.18 0 top
C24  56.06,26.71 0 top
C25  25.18,19.13 0 top
C26  20.09,11.09 0 top
C27  15.71,19.06 180 top
C28  13.01,5.4 180 top
C29  55.56,10.99 90 top
C30  35.52,23.35 270 top
C31  29.06,44.14 0 top
C32  40.84,44.12 0 top
C42  48.24,52.96 0 top
C43  23.36,4.41 0 top
C54  48.06,75.68 0 top
D3  20.13,9.67 270 top
D4  48.05,73.41 0 top
D5  21.67,15.03 90 top
D6  35.48,13.55 180 top
FLASH  9.05,16.35 270 top
IC1  23.54,22.76 0 top
J1  17.27,51.3 270 top
LED1  29.39,14.07 0 top
P1  53.34,44.83 90 top
P2  40.49,24.7 0 top
P3  48.05,33.2 0 top
P5  33.03,42.2 0 top
Q2  30.67,17.62 270 top
Q3  13.11,9.61 0 top
Q4  16.69,5.07 180 top
Q5  34.64,17.2 270 top
R1  24.43,10.21 90 top
R2  35.48,13.55 0 top
R3  56.82,21.18 270 top
R4  56.06,23.54 180 top
R5  55.17,21.18 270 top
R6  53.52,22.76 90 top
R7  30.81,33.25 90 top
R8  29.24,33.25 270 top
R9  23.6,33.3 90 top
R10  21.92,33.3 270 top
R11  27.66,6.58 180 top
R12  32.79,12.37 270 top
R13  27.66,5.05 0 top
R14  32.08,4.09 180 top
R15  24.82,7.01 90 top
R16  22.86,10.28 270 top
R17  35.39,11.78 180 top
R18  26.5,10.39 270 top
R19  58.47,19.43 90 top
R20  28.22,10.39 270 top
R21  44.5,52.95 180 top
R22  16.63,9.81 0 top
R23  19.48,7.2 90 top
R24  12.42,12.35 0 top
R25  13.08,6.98 0 top
R26  16.74,7.86 180 top
R27  21.99,19.09 180 top
R28  18.89,19.06 0 top
R29  29.68,24.29 180 top
R30  29.75,22.59 180 top
R31  32.29,23.31 90 top
R32  48.94,43.94 180 top
R33  20.21,4.44 0 top
R34  53.53,19.65 90 top
R35  25.46,33.27 90 top
R36  27.64,33.26 270 top
R37  36.01,33.21 270 top
R38  34.38,33.21 270 top
R39  32.81,33.21 270 top
R40  34.73,20.61 0 top
R41  33.91,23.36 90 top
R42  56.06,31.4 0 top
R43  56.06,28.29 0 top
R44  56.06,29.84 0 top
R45  27.86,17.84 90 top
R46  16.18,25.5 0 top
R47  56.08,32.99 0 top
R48  16.19,22.45 0 top
R49  57.11,11 90 top
R50  29.77,20.32 0 top
R51  25,13.85 0 top
R52  56.34,13.29 180 top
R53  21.2,7.25 270 top
R54  58.47,22.78 270 top
R67  51.99,74.98 90 top
R68  53.41,74.97 90 top
R69  54.8,74.98 90 top
R70  56.14,74.97 90 top
R71  57.53,74.97 90 top
R72  50.62,74.97 90 top
R86  47.85,40.49 270 top
R87  49.36,40.49 270 top
RST  9.05,9.42 270 top
SD  45.01,60.83 0 top
SJ1  13.15,15.17 270 top
U1  32.01,7.7 270 top
U2  23.25,45.77 0 top
U4  17.29,15.3 0 top
U5  45.39,49.98 0 top
U6  32.24,62.21 90 top
U7  48.86,50.08 0 top
U8  56.38,15.94 270 top
U$1  [MAKERFABS_0.3]  42.53,11.31 0 top
USB  13.49,24.2 270 top

### Tracks (layer width: path | path; a pad name or v marks a point on that pad's centre or on a via)
3.3V  (via drill 0.3)  (1 unrouted)
  Top 0.254: C29.2 v55.56,12.52 55.56,13.26 R52.2 55.6,13.31 55.6,16.58 55.25,16.94 U8.1 47.68,16.94 46.82,16.07 v42.85,16.07 | 46.02,33.98 46.06,33.94 P3.1 | 24.43,12.53 v24.41,12.54 | P2.1 39.16,24.7 39.04,24.58 | P5.7 40.08,42.55 P5.6 | 28.32,32.97 27.97,32.61 27.75,32.61 R36.2 27.77,32.64 | 27.64,32.64 27.77,32.64 | 29.06,32.66 28.48,33.25 28.4,33.25 27.79,32.64 27.77,32.64
  Top 0.305: v27.74,38.66 26.78,39.61 P5.33 26.78,43.96 C20.2 | P5.12 37.28,40.1 v37.11,39.93
  Top 0.61: C30.2 35.5,22.57 R40.2 38.85,20.61 v39.04,20.8 39.04,24.58 39.04,25.14 | v42.45,20.57 44.83,20.57 46.64,22.37 46.64,33.36 46.06,33.94 | v37.72,34.82 38.56,33.98 46.02,33.98 | R36.2 28.63,32.5 | 28.63,32.5 29.22,32.5 R8.2 | v28.45,33.12 28.45,32.68 28.63,32.5 | R10.2 21.75,32.53 v21.03,33.25 | v40.08,39.01 40.08,42.55 C32.1 | C21.2 56.84,34.51 R47.2 56.82,32.97 R42.2 R44.2 R43.2 C24.2 C23.2 v58.54,25.18 v58.55,25.17 | C20.2 C31.1
  Top 0.813: R1.2 24.43,12.53
  Bottom 0.254: 21.01,37.11 22.56,38.66 | 28.43,37.54 28.45,37.56 | 39.04,17.07 38.99,17.07 38.9,17.15
  Bottom 0.61: v55.56,12.52 57.66,12.52 58.55,13.41 v58.55,25.17
  Bottom 0.813: v24.41,12.54 27.94,16.07 38.74,16.07 | 38.74,16.07 40.03,16.07 | 40.03,16.07 v42.85,16.07 | 39.04,19.91 v39.04,20.8 39.27,20.57 v42.45,20.57 | 39.04,19.91 39.04,17.07 | 39.04,17.07 39.04,16.38 38.74,16.07 | 39.93,20.54 39.68,20.54 39.04,19.91 | 39.04,17.07 40.03,16.07 | 39.04,17.37 39.04,17.29 38.9,17.15 37.87,16.13 | 28.55,38.66 v27.74,38.66 22.56,38.66 21.03,37.13 v21.03,33.25 | 28.55,38.66 29.49,38.66 | 29.49,38.66 37.14,38.66 | 37.14,38.66 37.6,38.66 | 37.6,38.66 39.73,38.66 v40.08,39.01 | v37.72,34.82 37.72,37.92 | 37.72,37.94 37.72,38.53 37.6,38.66 | 37.11,39.47 37.11,38.68 37.14,38.66 | v28.45,33.12 28.45,37.56 28.45,38.55 28.55,38.66 | 28.48,37.59 28.48,37.64 29.49,38.66 | 37.72,37.92 37.72,37.94 | 37.72,37.94 36.99,38.68 | 37.72,37.92 38.43,38.63 | v37.11,39.93 37.11,39.47 | 37.11,39.47 37.87,38.71 | 37.09,39.9 37.09,39.32 36.55,38.78 | 28.43,37.54 28.43,37.61 27.41,38.63
  pour Top: 42.65,16.53 47.07,16.53 48.16,17.62 55.5,17.62 56.06,17.07 56.06,11.48 55.96,11.38 55.22,11.38 55.12,11.48 55.12,16.63 54.82,16.94 48.77,16.94 47.65,15.82 42.62,15.82 42.62,16.51
5V
  Top 0.254: U4.3 21.28,13.39 D5.C 23.31,13.01 R51.1 24.15,15.63 C16.1
  pour Top: 18.6,14.12 23.29,14.12 23.55,14.37 23.55,15.95 23.78,16.18 24.56,16.18 24.64,16.1 24.64,13.31 24.59,13.26 23.85,13.26 22.81,12.21 18.93,12.21 18.6,12.54
+3V3  (via drill 0.3)
  Top 0.254: C27.1 17.38,19.06 | 17.38,19.06 R28.1 18.04,20.09 | 17.38,19.06 17.29,18.97 U4.4 U4.2 C22.1 17.4,11.49 R22.2 18.95,9.81 D3.A | D3.A 19.48,9.28 R23.2 21.07,7.97 R53.1 22.71,8.1 C1.2 24.79,7.79 R15.2 | D3.A 19.09,10.94 C26.1 | R1.1 24.43,8.16 R15.2 | IC1.5 IC1.6 19.45,21.5 | U1.P$6 v28.17,7.95 26.77,7.95 | 26.77,7.95 25,7.95 R15.2 | R11.2 26.9,7.82 26.77,7.95 | U2.VDD33 U6.2 | U1.P$14 34.82,7.45 v34.95,7.31 | C42.1
  Top 0.305: P1.14 v58.21,44.08 v58.22,44.07
  Top 0.406: D4.4 48.8,75.67 C54.2
  Top 0.61: SD.4 48.19,61.93 52.55,66.28 v52.55,67.71 | U5.3 43.89,51.23 43.13,50.47 v43.13,44.9 44.2,43.84 45.35,43.84 R86.1 R87.1 | 46.54,51.38 46.59,51.38 47.4,52.19 47.5,52.19 48.29,51.41 48.79,51.41 U7.3 | R71.2 58.02,75.82 58.7,75.13 58.7,73.28 58.36,72.94 v58.36,67.26
  Top 0.813: v58.22,60.32 55.3,60.32 51.36,56.39 51.36,52.25 50.45,51.33 U7.3 47.58,51.33 | 47.58,51.33 45.5,51.33 | 45.5,51.33 U5.3 | 45.5,51.33 45.5,52.81 R21.1 | C42.1 47.39,51.52 47.58,51.33 | U2.VDD33 v24.72,68.63 | J1.1 17.28,69.09 C17.1 21.34,69.09 21.78,68.64 U6.2 | C54.2 50.48,75.68 R72.2 R67.2 R68.2 54.79,75.82 R69.2 56.13,75.83 R70.2 R71.2
  Bottom 0.254: 58.22,67.2 58.31,67.2 v58.36,67.26
  Bottom 0.61: v28.17,7.95 29.7,6.42 34.06,6.42 v34.95,7.31
  Bottom 0.813: v24.72,68.63 25.63,67.71 v52.55,67.71 57.71,67.71 58.22,67.2 v58.22,60.32 v58.22,44.07
  Bottom 1.016: v43.13,44.9 22.28,44.9 15.55,38.17 15.55,22.96 16.6,21.9 v18.61,21.9
  pour Top: 21.9,22.12 18.54,22.12 16.06,19.63 16.06,14.98 16.77,14.27 16.77,9.42 17.02,9.17 18.27,9.17 18.65,8.79 18.65,7.67 18.88,7.44 25.35,7.44 26.06,6.73 26.06,6.09 27.36,6.09 27.38,6.12 27.38,7.46 27.71,7.79 30.84,7.79 30.84,8.05 28.86,8.05 28.35,8.56 25.33,8.56 25.02,8.86 25.02,9.75 24.95,9.83 24.01,9.83 23.98,9.8 23.98,8.79 23.62,8.43 20.4,8.43 19.94,8.89 19.94,11.48 19.87,11.55 18.52,11.55 17.91,12.16 17.91,14.4 18.39,14.88 18.39,20.16 19.46,21.23 21.87,21.23 21.9,21.26
A0
  Top 0.254: U1.P$3 31.76,10.57 R12.2
  Top 0.406: R12.2 34.45,11.6 R17.2
CLK
  Top 0.254: U6.20 32.87,50.75 36.58,47.04 U2.CLK
CMD
  Top 0.254: U2.CMD 28.91,47.04 31.63,49.76 31.63,51.89 U6.19
CSI_1V2
  Top 0.254: P1.15 51.86,43.58 C14.1
  Top 0.406: U7.2 49.76,48.78 C13.1 49.76,45.68 C14.1
CSI_2V8
  Top 0.254: P1.21 50.81,40.58 50.55,40.84 50.55,41.96 50.17,42.34 47.91,42.34 46.31,43.94 46.31,45.46 C11.1
  Top 0.406: U5.2 46.3,48.68 C12.1 46.3,45.5 C11.1
CSI_D0  (via drill 0.3)
  Top 0.254: J1.13 14.41,38.61 12.42,40.59 12.42,62.56 v12.25,62.73 | v38.28,62.96 38.28,60.42 40.24,58.47 41.23,58.47 U6.29 U2.IO5 42.12,58.47 v42.62,58.98 | P1.6 55.35,48.08 v55.76,48.48
  Bottom 0.254: v12.25,62.73 12.45,62.53 16.61,62.53 17.86,63.78 36.02,63.78 36.83,62.96 v38.28,62.96 | v55.76,48.48 55.02,48.48 44.53,58.98 v42.62,58.98
CSI_D1  (via drill 0.3)
  Top 0.254: J1.12 14,41.15 12.88,42.26 12.88,63.19 v12.78,63.29 | v38.92,63.19 38.92,61.01 40.19,59.74 U2.IO18 | U6.30 U2.IO18 | v42.5,59.71 41.28,59.71 U2.IO18 | P1.4 54.7,49.08 55.05,49.43 v55.05,50.14
  Bottom 0.254: v12.78,63.29 13.01,63.07 16.34,63.07 17.55,64.28 36.33,64.28 37.09,63.52 38.59,63.52 v38.92,63.19 | v42.5,59.71 44.68,59.71 54.26,50.14 v55.05,50.14
CSI_D2  (via drill 0.3)
  Top 0.254: J1.11 14.81,43.69 13.41,45.08 13.41,63.6 v13.01,64 | U6.31 41.23,61.03 40.24,61.03 39.78,61.49 39.78,63.32 v39.04,64.06 | U2.IO19 U6.31 | v42.55,61.01 42.54,61.02 U6.31 | P1.3 54.23,49.58 54.46,49.81 v54.46,50.77
  Bottom 0.254: v13.01,64 13.44,63.57 16.06,63.57 17.28,64.79 36.66,64.79 37.39,64.06 v39.04,64.06 | v54.46,50.77 44.22,61.01 v42.55,61.01
CSI_D3  (via drill 0.3)
  Top 0.254: J1.10 15.62,46.23 13.9,47.95 13.9,63.98 v13.77,64.11 | v39.65,64.59 39.65,64.16 40.24,63.57 41.23,63.57 U6.33 U2.IO21 42.14,63.55 42.57,63.12 v42.57,61.85 | P1.5 54.88,48.58 55.63,49.32 v55.63,50.52
  Bottom 0.254: v13.77,64.11 15.83,64.11 16.95,65.22 37.06,65.22 37.7,64.59 v39.65,64.59 | v42.57,61.85 42.78,61.64 44.5,61.64 v55.63,50.52
CSI_D4  (via drill 0.3)
  Top 0.254: J1.3 19.46,64 21.57,66.11 23.23,66.11 U6.4 U2.SENSOR_VP 24.39,66.09 25.61,64.87 v25.61,59.31 | P1.7 55.79,47.58 v55.91,47.7
  Bottom 0.254: v25.61,59.31 26.52,58.39 44.4,58.39 55.1,47.7 v55.91,47.7
CSI_D5  (via drill 0.3)
  Top 0.254: J1.4 18.65,61.47 22,64.82 23.23,64.82 U6.5 U2.SENSOR_VN 23.28,64.79 24.29,64.79 25.05,64.03 25.05,58.82 v25.15,58.72 | P1.9 55.99,46.58 v56.24,46.33
  Bottom 0.254: v25.15,58.72 25.94,57.93 44.05,57.93 55.65,46.33 v56.24,46.33
CSI_D6  (via drill 0.3)
  Top 0.254: U6.6 U2.IO34 24.23,63.55 24.59,63.19 24.59,58.21 v24.74,58.06 | P1.11 54.96,45.58 v55.3,45.23
  Bottom 0.254: v24.74,58.06 25.35,57.45 43.74,57.45 55.3,45.9 v55.3,45.23
CSI_D7  (via drill 0.3)
  Top 0.254: U2.IO35 U6.7 23.23,62.3 21.9,62.3 v21.47,61.87 18.52,58.93 J1.5 | P1.13 52.22,44.58 v52.07,44.73
  Bottom 0.254: v52.07,44.73 52.07,47.37 42.93,56.51 24.67,56.51 21.47,59.71 v21.47,61.87
CSI_HSYNC  (via drill 0.3)
  Top 0.254: J1.9 15.42,48.77 14.35,49.83 v14.35,66.06 | v38.94,66.85 38.94,68.09 39.47,68.63 41.23,68.63 U6.37 U2.IO23 42.62,68.63 43.62,67.64 v43.62,65.02 | P1.16 v55.32,43.08
  Bottom 0.254: v14.35,66.06 15.29,67 38.79,67 v38.94,66.85 | v43.62,65.02 43.62,64.16 57.03,50.75 57.03,44.78 v55.32,43.08
CSI_MCLK  (via drill 0.3)
  Top 0.254: U2.IO32 U6.8 | 23.23,61.01 U6.8 | U6.8 22.24,61.02 v22.13,60.91 17.61,56.39 J1.6 | P1.12 54.54,45.08 v54.64,44.98
  Bottom 0.254: v22.13,60.91 22.13,59.76 24.92,56.97 43.39,56.97 54.64,45.72 v54.64,44.98
CSI_PCLK  (via drill 0.3)
  Top 0.254: C19.1 51.72,47.08 P1.8 56.38,47.08 v56.49,46.96 | J1.7 15.34,53.85 14.81,54.38 14.81,65.4 v15.09,65.68 | v39.78,66.85 40.3,67.37 U6.36 U2.IO22 42.42,67.36 42.68,67.1 v42.68,63.95
  Bottom 0.254: v15.09,65.68 15.98,66.57 38.18,66.57 38.43,66.32 39.25,66.32 v39.78,66.85 | v42.68,63.95 43.03,63.95 56.49,50.49 v56.49,46.96
CSI_RST  (via drill 0.3)
  Top 0.254: 20.97,6.17 R53.2 | v57.81,40.76 57,41.58 P1.19 | R33.2 20.98,4.46
  Top 0.406: R53.2 20.98,6.18 v20.98,5.38 20.97,5.37 R33.2 21.01,4.41 C43.1
  Bottom 0.254: v57.81,40.76 59.21,39.37 59.21,11.32 53.27,5.38 v20.98,5.38
CSI_VSYNC  (via drill 0.3)
  Top 0.254: U2.IO25 U6.10 | U2.IO25 | J1.8 20.83,54.86 20.83,57.4 21.9,58.47 21.95,58.47 | 21.95,58.47 U2.IO25 | v21.87,58.47 21.95,58.47 | P1.18 54.99,42.08 v55.27,42.36
  Bottom 0.254: v21.87,58.47 24.31,56.03 42.57,56.03 51.46,47.14 51.46,44.29 53.39,42.36 v55.27,42.36
D+
  Top 0.254: USB.A6 18.09,24.46 19.54,23 IC1.3 | USB.A6 | USB.A6 12.2,24.46 11.89,24.76 11.41,24.76 11.03,24.38 11.03,23.82 11.41,23.44 USB.B6
D-  (via drill 0.3)
  Top 0.254: v11.99,25.5 11.99,25.35 12.4,24.94 USB.B7 | v11.61,24.1 11.76,23.95 USB.A7 17.78,23.95 19.23,22.5 IC1.4
  Bottom 0.254: v11.99,25.5 11.99,24.48 v11.61,24.1
DTR  (via drill 0.3)
  Top 0.254: IC1.23 22.79,25.45 22.58,25.65 21.8,25.65 21.57,25.42 v21.57,24.63 | v13.21,30.76 17.22,30.76 v17.45,30.98 | Q3.2 14.06,8.62
  Top 0.406: Q3.2 15.25,8.59 R26.2 | 14.06,8.62 v13.29,9.39
  Bottom 0.254: v13.21,30.76 14.07,29.89 14.07,28.06 13.14,27.12 13.14,21.59 14.53,20.19 14.53,19 13.29,17.75 v13.29,9.39 | v17.45,30.98 19.15,29.28 19.15,26.21 20.73,24.63 v21.57,24.63
GND  (via drill 0.3)
  Top 0.254: IC1.2 22.79,23.5 IC1.THERM | P3.2 47.3,21.84 45.09,19.63 42.12,19.63 41.71,20.04 41.71,21.54 42.19,22.02 P2.7 | R48.2 16.69,22.45 | P1.10 55.45,46.08 v56.16,45.36 | P1.23 54.27,39.58 54.28,39.6 | v54.84,39.9 54.51,39.57 50.24,39.57 | P5.5 40.78,37.75 40.77,37.74 40.29,37.74 39.07,38.96 v39.07,40.89 | 26.09,36.12 24.78,37.42 P5.37 24.78,44.92 24.79,44.93
  Top 0.61: R48.2 17.07,22.48
  other vias: 17.07,23.31 17.38,26.87 24.41,23.67 8.41,35.35 22.76,23.64 22.79,22.78 23.55,22.78 24.39,22.78 24.36,21.87 43.59,12.04 49.53,70.81 22.63,21.87 23.55,21.89 25.96,20.62 28.2,21.49 32.06,20.9 36.91,19.4 42.75,23.85 37.39,23.95 33.07,25.27 33.07,14.7 37.98,12.21 44.91,10.82 46.94,13.48 50.52,7.11 56.98,3.1 60.38,4.85 60.84,1.9 56.72,6.17 38.26,3.22 43.46,3.4 47.93,3.4 34.67,3.4 4.73,1.22 8.66,2.05 6,3.27 4.96,5.25 7.27,11.17 7.47,17.9 7.98,22.93 7.88,25.83 7.52,30.86 12.17,30.22 17.25,28.22 23.52,23.59 7.75,39.01 7.8,49.96 7.83,55.75 7.83,59.84 8.46,64.31 10.92,73.25 5.9,73.2 16.06,73.81 5.59,75.74 10.85,76.27 8.66,69.75 7.75,44.75 9.22,53.24 29.24,62.46 31.32,62.99 33.3,62.86 34.62,62.76 36.2,62.15 37.24,61.82 37.77,59.53 35.99,59.48 32.72,59.31 52.1,3.55 28.83,59.31 29.21,61.19 31.58,61.44 33.43,61.39 35.05,61.13 36.68,60.68 30.76,59.84 34.39,59.94 59.26,63.5 50.88,61.46 54.51,57.43 59.24,57.68 61.04,72.67 61.22,76.37 60.51,75.08 55.45,72.13 60.05,73.53 47.32,70.1 43.39,70.13 37.52,70.13 34.95,70.1 25.81,69.87 27,70.02 30.64,70.1 38.61,54.43 32.06,54.28 30.2,54.3 25.48,51.58 32.59,47.29 30.64,46.68 21.11,47.32 22.3,43.02 46.28,40.94 46.23,37.51 44.76,37.49 51.08,36.93 50.85,34.87 53.98,34.95 58.78,42.11 57.94,38.63 58.47,35.15 51.39,25.96 51.67,21.89 51.01,19.25 52.94,10.56 28.27,40.69 29.42,40.05 31.6,40.84 33.81,40.05 34.6,40.89 32.62,39.82 30.58,40 31.83,43.66 36.02,36.88 29.92,35.15 22.48,35.58 22.48,36.85 19.89,33.65 13.31,36.27 11.23,6.14 11.23,10.69 11.33,14.45 12.45,18.64 15.22,14.6 24.06,3.15 18.34,3.04 12.75,3.12 42.85,14.63 38.51,14.8 27.38,19.91 32.44,19.4 36.81,25.24 43.16,25.63 58.4,28.44 58.3,31.77 56.52,42.95 56.39,54.05 45.37,66.42 55.78,62.4 52.17,62.89 62.33,76.91 12.4,67.33 23.52,12.09
  pour Top (isolate 0.203, rank 6): -15.31,97.23 -15.31,-11.73 91.14,-10.72 91.14,98.24
  pour Bottom (isolate 0.203, rank 6): -14.78,-11.48 99.27,-11.48 99.27,98.24 -14.78,98.24
IM0
  Top 0.254: P5.38 24.28,36.4 25.4,35.28 27.97,35.28 R8.1
  Top 0.406: R8.1 R7.2
IM1
  Top 0.254: P5.39 23.78,35.71 R35.2
  Top 0.406: R35.2 R36.1
IM2
  Top 0.254: P5.40 23.28,34.38 R9.2
  Top 0.406: R10.1 R9.2
IO0/LCD_IRQ  (via drill 0.3)  (1 unrouted)
  Top 0.254: R22.1 | U1.P$2 32.26,10.11 32.57,10.41 32.92,10.41 | P2.4 40.74,17.9 | 40.74,17.9 40.74,11.37 39.78,10.41 32.92,10.41 | U6.25 41.23,53.41 42.14,53.41 v42.73,54 | U8.7 57.69,15.44 v57.48,15.24 | v42.09,17.9 46.16,17.9 49.33,21.08 49.33,28.88 48.92,29.28 v48.92,32.03 48.8,32.15 P3.5 48.8,36.3 v49.46,36.95 | v40.62,17.9 40.74,17.9 | v32.9,10.31 32.9,10.38 32.92,10.41 | R42.1 55.2,31.49
  Top 0.305: 55.2,31.49 54.36,32.33 v53.52,32.33 v50.22,32.33
  Top 0.406: R22.1 15.37,9.8 v14.96,10.21 14.55,10.63 Q3.3 13.11,12.28 R24.2 13.18,14.38 SJ1.2
  Bottom 0.254: v57.48,15.24 56.77,15.95 56.77,21.33 53.34,24.76 53.34,32.15 v53.52,32.33 | v40.62,17.9 v42.09,17.9 | v32.9,10.31 15.07,10.31 v14.96,10.21 | v42.73,54 50.32,46.4 50.32,43.79 52.23,41.88 52.23,39.72 v49.46,36.95
  Bottom 0.305: v48.92,32.03 49.23,32.33 v50.22,32.33
IO2/SPI_NCS2  (via drill 0.3)
  Top 0.254: 10.92,15.93 v10.9,15.95 | v28.81,53.62 37.37,53.62 37.98,53.01 37.98,51.93 U6.24
  Top 0.406: 10.92,15.93 SJ1.1 14.14,15.93 14.48,15.59 14.48,11.48 v14.35,11.35 | R20.1 28.6,11.53 v29.06,11.53 | R21.2 42.81,52.12 U2.IO2 38.16,52.12 U6.24
  Bottom 0.254: v28.81,53.62 25.17,53.62 10.57,39.01 10.57,16.28 v10.9,15.95 | v29.06,11.53 25.35,11.53 24.69,10.87 14.84,10.87 v14.35,11.35
IO4  (via drill 0.3)
  Top 0.254: U2.IO4 U6.26 42.79,54.67 43.21,55.09 43.21,63.45 43.89,64.13 SD.2
  Top 0.305: SD.2 47.83,64.13 51.24,67.53 51.24,72.01 51.3,72.07 v51.67,72.44 52,72.77 52,74.12 R67.1 | D4.1 v47.3,71.84 v47.3,71.83
  Bottom 0.305: v47.3,71.83 47.91,72.44 v51.67,72.44
IO12/HMISO  (via drill 0.3)  (1 unrouted)
  Top 0.254: R12.1 33.71,13.13 | 33.71,13.13 33.83,13.13 | 25.43,53.39 U2.IO12 U6.14 | 25.43,53.39 26.35,53.39 27.36,54.4 27.36,68.76 v27.03,69.09 27.26,68.86 | v14.35,17.19 v11.38,17.19 | v25.38,52.78 25.38,53.16 | 25.43,53.39 25.38,53.34 25.38,53.16 | 33.71,13.13 33.71,12.8 v33.68,12.77 33.68,12.95 D6.- R2.1 | 25.1,53.39 25.35,53.13 | 25.35,53.13 25.45,53.13 25.68,53.36 | 25.35,53.13 25.38,53.16 | 33.71,12.77 33.48,13 33.12,13 | 33.68,13.15 34.09,13.56 34.17,13.64 34.6,13.64 | v56.79,69.42 56.87,69.42 | 47.32,74.29 D4.6
  Top 0.305: SD.7 49.82,58.63 56.87,65.68 56.87,69.42 56.87,72.39 v56.51,72.76 56.14,73.12 R70.1 | 47.32,74.29 v47.32,73.71
  Top 0.406: 33.71,13.13 34.09,13.51 34.09,13.56
  Bottom 0.254: v27.03,69.09 27.26,68.86 52.63,68.86 53.19,69.42 v56.79,69.42 | v33.68,12.77 33.05,12.14 25.23,12.14 24.54,11.45 15.19,11.45 14.35,12.29 v14.35,17.19 | v11.38,17.19 11.03,17.55 11.03,38.43 v25.38,52.78
  Bottom 0.305: v56.51,72.76 54.94,74.32 47.65,74.32 47.32,73.99 v47.32,73.71
IO13/HMOSI  (via drill 0.3)
  Top 0.254: P5.13 36.78,45.92 v32.26,50.44 | v20.93,50.49 21.29,50.85 U2.IO13 25.25,50.85 25.81,50.29 v26.93,50.29 27.21,50.29 27.79,50.87 U6.16 | U6.16 v27.79,69.36 | U6.16 | v51.95,69.69 51.9,69.69 51.84,69.64
  Top 0.305: SD.3 47.85,63.03 51.84,67.03 51.84,69.64 51.84,71.47 v53.32,72.95 53.42,73.05 53.42,74.11 R68.1 | D4.3 49.2,72.51 v49.79,73.1
  Top 0.406: R13.1 v26.9,4.26
  Bottom 0.254: v27.79,69.36 51.62,69.36 v51.95,69.69 | v26.9,4.26 11.41,4.26 10.11,5.56 10.11,39.67 v20.93,50.49 | v26.93,50.29 32.11,50.29 v32.26,50.44
  Bottom 0.305: v49.79,73.1 53.17,73.1 v53.32,72.95
IO14/HSCLK  (via drill 0.3)  (1 unrouted)
  Top 0.254: R3.1 R4.1 | v26.29,68.88 26.93,68.25 26.93,54.84 26.04,53.95 24.51,53.95 23.8,54.66 U2.IO14 U6.13
  Top 0.305: SD.5 v48.54,60.83 53.32,65.61 v53.32,68.76 53.32,71.68 54.74,73.1 v54.79,73.1 | 54.79,73.15 R69.1 | D4.5 v48.05,73.66 v48.06,73.66
  Top 0.406: R4.1 v57.66,23.54 R54.1
  Bottom 0.254: v26.29,68.88 26.72,68.45 53.01,68.45 v53.32,68.76 | v48.54,60.83 48.54,59.99 57.48,51.05 57.48,42.67 56.16,41.35 56.16,25.04 v57.66,23.54
  Bottom 0.305: v48.06,73.66 48.14,73.73 54.16,73.73 v54.79,73.1
IO15/HNSS0  (via drill 0.3)
  Top 0.254: U2.IO15 39.4,50.85 38.99,50.44 v38.46,50.44 37.95,50.44 37.14,50.44 36.68,50.9 U6.23 | P5.9 38.78,46.38 v38.76,46.4
  Bottom 0.254: v38.76,46.4 38.76,50.14 v38.46,50.44
IO16
  Top 0.254: U6.27 U2.NC1
IO17
  Top 0.254: U2.NC2 U6.28
IO33/LCD_RS  (via drill 0.3)
  Top 0.254: U6.9 U2.IO33 21.95,59.74 v21.24,59.03
  Top 0.406: R5.1 55.12,21.99 v54.38,21.99 R6.1 53.53,21.98 R34.2
  Bottom 0.254: v21.24,59.03 21.24,58.26 23.96,55.55 42.35,55.55 50.93,46.96 50.93,44.07 52.86,42.14 52.86,24.41 54.38,22.88 v54.38,21.99
LCD_BCK
  Top 0.406: R31.2 32.34,24.12 R41.2
LCD_P10  (via drill 0.3)
  Top 0.254: P5.10 38.28,38.93 40.59,36.62 43.72,36.62 v43.79,36.7
  Top 0.406: R5.2 v55.98,20.42 R3.2
  Bottom 0.254: v55.98,20.42 48.42,20.42 46.64,22.2 46.64,33.86 v43.79,36.7
LCD_P11  (via drill 0.3)
  Top 0.254: P5.11 37.78,38.67 40.31,36.14 v45.16,36.14
  Top 0.406: v51.24,23.52 R6.2 55.27,23.52 R4.2
  Bottom 0.254: v51.24,23.52 48.03,23.52 47.09,24.46 47.09,34.21 v45.16,36.14
LCD_SCK  (via drill 0.3)
  Top 0.254: R19.2 56.75,18.46 v54.92,18.46 | U1.P$4 30.78,9.2 v30.76,9.22
  Top 0.406: R19.2 R54.2
  Bottom 0.254: v30.76,9.22 53.09,9.22 54,10.13 54,17.55 v54.92,18.46
LCD_SDA
  Top 0.254: 28.25,9.6 R20.2
  Top 0.305: R20.2 29.31,8.53 30.43,8.53 U1.P$5
  Top 0.406: R18.2 R20.2
MODE
  Top 0.254: 31.19,6.4 31.19,6.14 U1.P$9
  Top 0.406: R15.1 25.56,5.51 25.56,4.47 26.55,3.48 30.71,3.48 R14.2 31.19,4.21 31.19,6.4
MOSI
  Top 0.254: U1.P$7 29.3,7.45 R11.1
  Top 0.406: R13.2 R11.1
N$1
  Top 0.254: IC1.16 26.74,23 C18.1
N$2
  Top 0.406: Q4.1 17.65,7.72 R26.1
N$3
  Top 0.406: R25.1 12.32,8.43 Q3.1
N$4  (via drill 0.3)
  Top 0.254: R2.2 36.26,13.56 36.27,13.55 D6.+ | P5.14 36.28,39.38 40.08,35.58 v40.64,35.58
  Top 0.406: D6.+ v37.67,13.56
  Bottom 0.254: v37.67,13.56 43.92,13.56 44.35,13.99 44.35,32.41 41.18,35.58 v40.64,35.58
N$5
  Top 0.406: R45.2 29.06,18.61 | 29.06,18.61 29.65,18.61 Q2.1 | R50.1 29.06,20.32 29.06,19.15 | 29.06,19.15 29.06,18.61 | 29.06,19.15 28.53,18.61
N$6
  Top 0.406: FLASH.2 R24.1
N$7
  Top 0.254: 22.62,9.67 R16.2
  Top 0.406: D3.C 22.62,9.67
N$8
  Top 0.61: 27.54,13.85 R51.2 27.67,13.85 LED1.1
N$9
  Top 0.254: Q2.3
  Top 0.61: Q2.3 31.68,14.8 30.94,14.07 LED1.2
N$10
  Top 0.254: USB.A5 15.28,25.45 R46.1
N$11
  Top 0.254: USB.B5 R48.1
N$12
  Top 0.254: R28.2 21.12,19.06 R27.2 21.14,20.4 21.5,20.75 IC1.7
  pour Top: 22.25,20.82 19.94,20.82 19.28,20.16 19.28,18.67 21.62,18.67 21.62,20.24 21.77,20.39 21.87,20.49 22.25,20.49
N$18
  Top 0.254: IC1.21 23.79,25.59 24.16,25.96 27.26,25.96 R29.2
N$19
  Top 0.254: IC1.20 24.29,25.27 24.51,25.5 26.19,25.5 28.99,22.7 R30.2
N$20
  Top 0.254: R37.1 36,34 36,35.28 34.81,36.46 33.86,37.41 33.61,37.67 27.66,37.67 26.28,39.05 P5.34
N$21
  Top 0.254: P5.35 25.78,38.63 27.41,37.01 33.07,37.01 34.37,35.71 R38.1
N$22
  Top 0.254: P5.36 25.28,38.37 27.13,36.52 31.98,36.52 32.82,35.68 32.82,33.98 R39.1
N$23
  Top 0.406: Q5.1 33.97,18.58 R40.1 33.91,20.67 R41.1
N$24  (via drill 0.3)
  Top 0.406: Q5.3 35.06,17.88 v35.06,18.39 | R37.2 R38.2 R39.2 32.18,32.45 v32.01,32.28
  Bottom 0.254: v35.06,18.39 35.06,25.5 34.5,26.06 21.67,26.06 20.58,27.15 20.58,30.17 22.2,31.8 31.52,31.8 v32.01,32.28
N$25
  Top 0.254: 57.08,13.31 R52.1 56.77,13.62 56.77,15.64 57.07,15.94 U8.8
  Top 0.406: R49.2 R52.1
N$47
  Top 0.305: SD.1 47.94,65.23 50.62,67.91 R72.1
N$48
  Top 0.254: SD.8
  Top 0.305: SD.8 49.79,57.53 57.53,65.27 R71.1
NC
  Top 0.254: U2.NC0 U6.32
PWDN
  Top 0.254: P1.17 52.04,42.58 50.68,43.94 R32.1
RESET  (via drill 0.3)  (1 unrouted)
  Top 0.254: U2.EN 24.74,67.36 26.34,65.76 26.34,55.34 v25.71,54.71 | 19.48,5.57 v19.49,5.56 | v41.76,12.24 41.24,12.76 41.24,17.34 | 41.24,17.34 P2.5 | v47.25,35.63 46.61,35 39.86,35 35.78,39.07 P5.15 v35.78,45.86 v35.79,45.87 | v49.48,35.76 49.3,35.58 P3.6 | P3.6 49.48,33.02 49.48,29.46 49.84,29.11 49.84,20.75 46.43,17.34 41.63,17.34 | 41.63,17.34 41.24,17.34 | 41.63,17.34 41.28,17.7 41.28,16.99 41.61,17.32 | 49.3,33.05 P3.6 | 49.46,32.74 49.71,32.99 49.69,32.99 49.3,33.37 P3.6
  Top 0.305: R47.1 49.51,32.99 P3.6
  Top 0.406: RST.2 10.41,4.05 13.87,4.05 | 13.87,4.05 Q4.3 19.06,4.05 R33.1 19.45,5.52 v19.49,5.56 | C28.1 13.87,5.39 13.87,4.62 | 13.87,4.62 13.87,4.05 | 19.48,5.57 R23.1 | 13.31,4.06 13.87,4.62 | 13.87,4.62 14.43,4.06
  Bottom 0.254: v19.49,5.56 19.49,7.92 21.31,9.75 39.27,9.75 v41.76,12.24 | v47.25,35.63 49.36,35.63 v49.48,35.76 | v35.79,45.87 35.79,54.15 35,54.94 25.94,54.94 v25.71,54.71
RTS  (via drill 0.3)
  Top 0.254: Q4.2 15.51,6.32 | IC1.19 25.33,24.75 v25.45,24.63 | v14.58,30.2 v17.45,30.2 | v14.58,6.98
  Top 0.406: R25.2 v14.58,6.98 | v14.58,6.98 | v14.58,6.98 14.85,6.98 Q4.2
  Bottom 0.254: v14.58,30.2 14.58,27.81 13.67,26.89 13.67,21.79 15.22,20.24 15.22,18.87 13.77,17.42 13.77,10.31 14.58,9.5 v14.58,6.98 | v17.45,30.2 18.65,29 18.65,25.93 20.53,24.05 21.95,24.05 22.53,24.63 v25.45,24.63
RXD  (via drill 0.3)
  Top 0.254: v39.83,65.3 40.3,64.83 U6.34 U2.RXD0 | v30.46,25.07 30.46,24.31 R29.1 | v11.13,64.61 11.13,33.86 13.19,31.8 v18.04,31.8
  Top 0.406: R50.2 v30.54,21.1 v30.53,21.1
  Bottom 0.254: v39.83,65.3 37.77,65.3 37.37,65.71 16.69,65.71 15.6,64.61 v11.13,64.61 | v18.04,31.8 18.14,31.7 18.14,30.96 19.64,29.46 19.64,26.51 20.96,25.19 30.33,25.19 v30.46,25.07 30.46,21.18 v30.53,21.1
SD0
  Top 0.254: U2.SD0 36.63,48.31 34.14,50.8 U6.21
SD1
  Top 0.254: U2.SD1 36.55,49.58 35.41,50.72 U6.22
SD2
  Top 0.254: U2.SD2 27.87,49.58 29.06,50.77 U6.17
SD3
  Top 0.254: U2.SD3 28.33,48.31 30.33,50.31 U6.18
TWI_SCK  (via drill 0.3)
  Top 0.254: U8.10 58.49,17.5 | 58.49,17.5 58.49,17.73 | 58.49,17.73 58.49,18.65 R19.1 58.42,18.72 | J1.14 18.65,36.07 19.15,36.57 v19.15,36.9 19.15,51.81 21.44,54.1 21.44,55.47 21.9,55.93 U2.IO27 U6.12 | P1.20 51.18,41.08 v51.13,41.12 | v46.74,39.8 47.69,39.8 R86.2 47.8,39.6 P3.3 47.8,28.25 v48.26,27.78 48.26,21.46 45.82,19.02 v43.06,19.02 | P2.3 40.24,25.22 | 40.24,25.22 40.24,19.1 v40.16,19.02 | v57.81,17.73 58.49,17.73 | v51.18,27.78 54.05,27.78 v54.41,28.14 54.56,28.29 R43.1 | 40.24,25.22 v40.24,26.36 | v19.76,31.01 19.76,29.66 v21.19,28.24 | 58.45,17.98 58.22,17.75 58.22,17.7 58.47,17.45 58.47,17.48 58.49,17.5
  Bottom 0.254: v51.13,41.12 48.06,41.12 v46.74,39.8 | v57.81,17.73 57.81,21.84 54.36,25.29 54.36,28.09 v54.41,28.14 | v51.18,27.78 v48.26,27.78 | v40.16,19.02 v43.06,19.02 | v19.76,31.01 19.15,31.62 v19.15,36.9 | v40.24,26.36 40.11,26.49 21.95,26.49 21.19,27.25 v21.19,28.24
TWI_SDA  (via drill 0.3)
  Top 0.254: U2.IO26 U6.11 22.19,57.21 v21.54,56.56 | U8.9 57.47,16.44 v57.38,16.53 | v42.57,18.46 45.95,18.46 48.82,21.33 48.82,28.45 v48.72,28.55 48.3,28.97 P3.4 48.3,37.75 49.36,38.81 49.36,39.63 R87.2 49.8,40.08 P1.22 | 19.18,33.14 19.18,29.23 21.92,26.49 39.27,26.49 39.74,26.02 P2.2 39.74,19.54 39.5,19.3 39.5,18.79 39.51,18.79 v39.94,18.36 39.94,12.3 v39.45,11.81 | 19.18,33.14 19.18,33.65 | 19.18,33.65 19.18,33.91 | 19.18,33.91 19.18,35.18 19.82,35.81 19.82,51.2 v21.75,53.13 | 19.18,33.65 19.05,33.53 18.8,33.53 19.18,33.91 | 18.82,33.5 19.18,33.14 | R44.1 54.89,29.84 v54.46,29.41 53.6,28.55 v51.18,28.55
  Top 0.406: R18.1 26.24,10.89 v25.73,10.89 | J1.15 18.8,33.53
  Bottom 0.254: v57.38,16.53 57.25,16.66 57.25,21.66 53.83,25.09 53.83,28.77 v54.46,29.41 | v51.18,28.55 v48.72,28.55 | v25.73,10.89 38.54,10.89 v39.45,11.81 | v21.75,53.13 21.75,56.36 v21.54,56.56 | v42.57,18.46 40.04,18.46 v39.94,18.36
TXD  (via drill 0.3)
  Top 0.254: v40.03,66.14 41.2,66.14 U6.35 U2.TXD0 | 32.23,22.6 R31.1 | 30.52,22.6 R30.1 | v11.69,65.17 11.66,34.19 13.49,32.36 v18.62,32.36
  Top 0.406: 30.52,22.6 v31.42,22.6 32.23,22.6
  Bottom 0.254: 39.78,65.88 v40.03,66.14 39.73,65.83 38.1,65.83 37.8,66.14 16.46,66.14 15.37,65.05 11.81,65.05 v11.69,65.17 | v31.42,22.6 31.42,25.29 31.09,25.62 21.24,25.62 20.12,26.74 20.12,29.84 18.62,31.34 v18.62,32.36
VBUS  (via drill 0.3)
  Top 0.254: IC1.8 22.79,19.14 R27.1 | D5.A 21.94,17.06 22.84,17.95 R27.1 | R27.1 24.28,19.09 C25.1 24.21,19.02 24.21,18.36 C15.1
  Top 0.61: USB.VBUS1 14.34,26.65 v14.35,26.67 | v22.56,18.39 24.18,18.39 24.21,18.36 | USB.VBUS2 13.96,21.75 14.51,21.21 v15.32,21.21
  Bottom 0.61: v14.35,26.67 14.35,22.17 14.48,22.04 v15.32,21.21 15.88,20.65 20.3,20.65 v22.56,18.39
  pour Top: 22.66,21.15 22.66,20.09 22.33,19.76 22.33,18.36 21.67,17.7 21.67,17.07 21.8,16.94 24.51,16.94 24.82,17.24 24.82,19.53 24.72,19.63 23.22,19.63 22.91,19.94 22.91,21.15
XL  (via drill 0.3)
  Top 0.254: U1.P$16 47.14,8.45 51.49,12.8 v51.49,15.01 51.92,15.44 U8.4 | P5.1 42.78,38.42 v43.01,38.2
  Bottom 0.254: v43.01,38.2 43.01,36.57 46.18,33.4 46.18,21 51.49,15.69 v51.49,15.01
XR  (via drill 0.3)
  Top 0.254: P5.3 41.78,37.34 v41.79,37.26 | U1.P$13 34.12,6.95 34.39,6.68 47.58,6.68 53.24,12.34 v53.24,13.76 | U8.2 51.22,16.44 v50.12,15.34
  Bottom 0.254: v41.79,37.26 41.79,36.45 45.27,32.97 45.27,20.27 50.12,15.41 v50.12,15.34 50.12,13.86 50.4,13.59 53.06,13.59 v53.24,13.76
YD  (via drill 0.3)
  Top 0.254: U1.P$15 47.56,7.95 52.33,12.72 v52.33,12.98 | P5.4 41.28,37.39 v41.1,37.21 | U8.3 51.61,15.94 50.4,14.73 v49.38,14.73
  Bottom 0.254: v41.1,37.21 41.1,36.37 44.81,32.66 44.81,19.94 49.48,15.26 49.48,14.73 | v52.33,12.98 50.07,12.98 49.48,13.56 49.48,14.73 | v49.38,14.73 49.48,14.73
YU  (via drill 0.3)
  Top 0.254: P5.2 42.28,37.83 v42.37,37.74 | U1.P$1 46.85,9.2 50.78,13.13 v50.78,14.17 | U8.5 52.64,14.94 v52.05,14.35
  Bottom 0.254: v42.37,37.74 42.37,36.52 45.72,33.17 45.72,20.67 50.78,15.62 50.78,14.7 | 50.78,14.7 v50.78,14.17 50.96,14.35 51.13,14.35 | v52.05,14.35 51.13,14.35 | 51.13,14.35 50.78,14.7

### Text on the board
tPlace: +3V3 | GND | IO36 | IO39 | IO35 | IO32 | IO22 | IO25 | IO23 | IO21 | IO19 | IO18 | IO5 | IO27 | IO26 | ESP32 TFT Touch | with Camera v1.1 | (3.2'' ili9341) | www.makerfabs.com